# Altium project Блок вычислительный.PrjPcb (part 1 of 2)
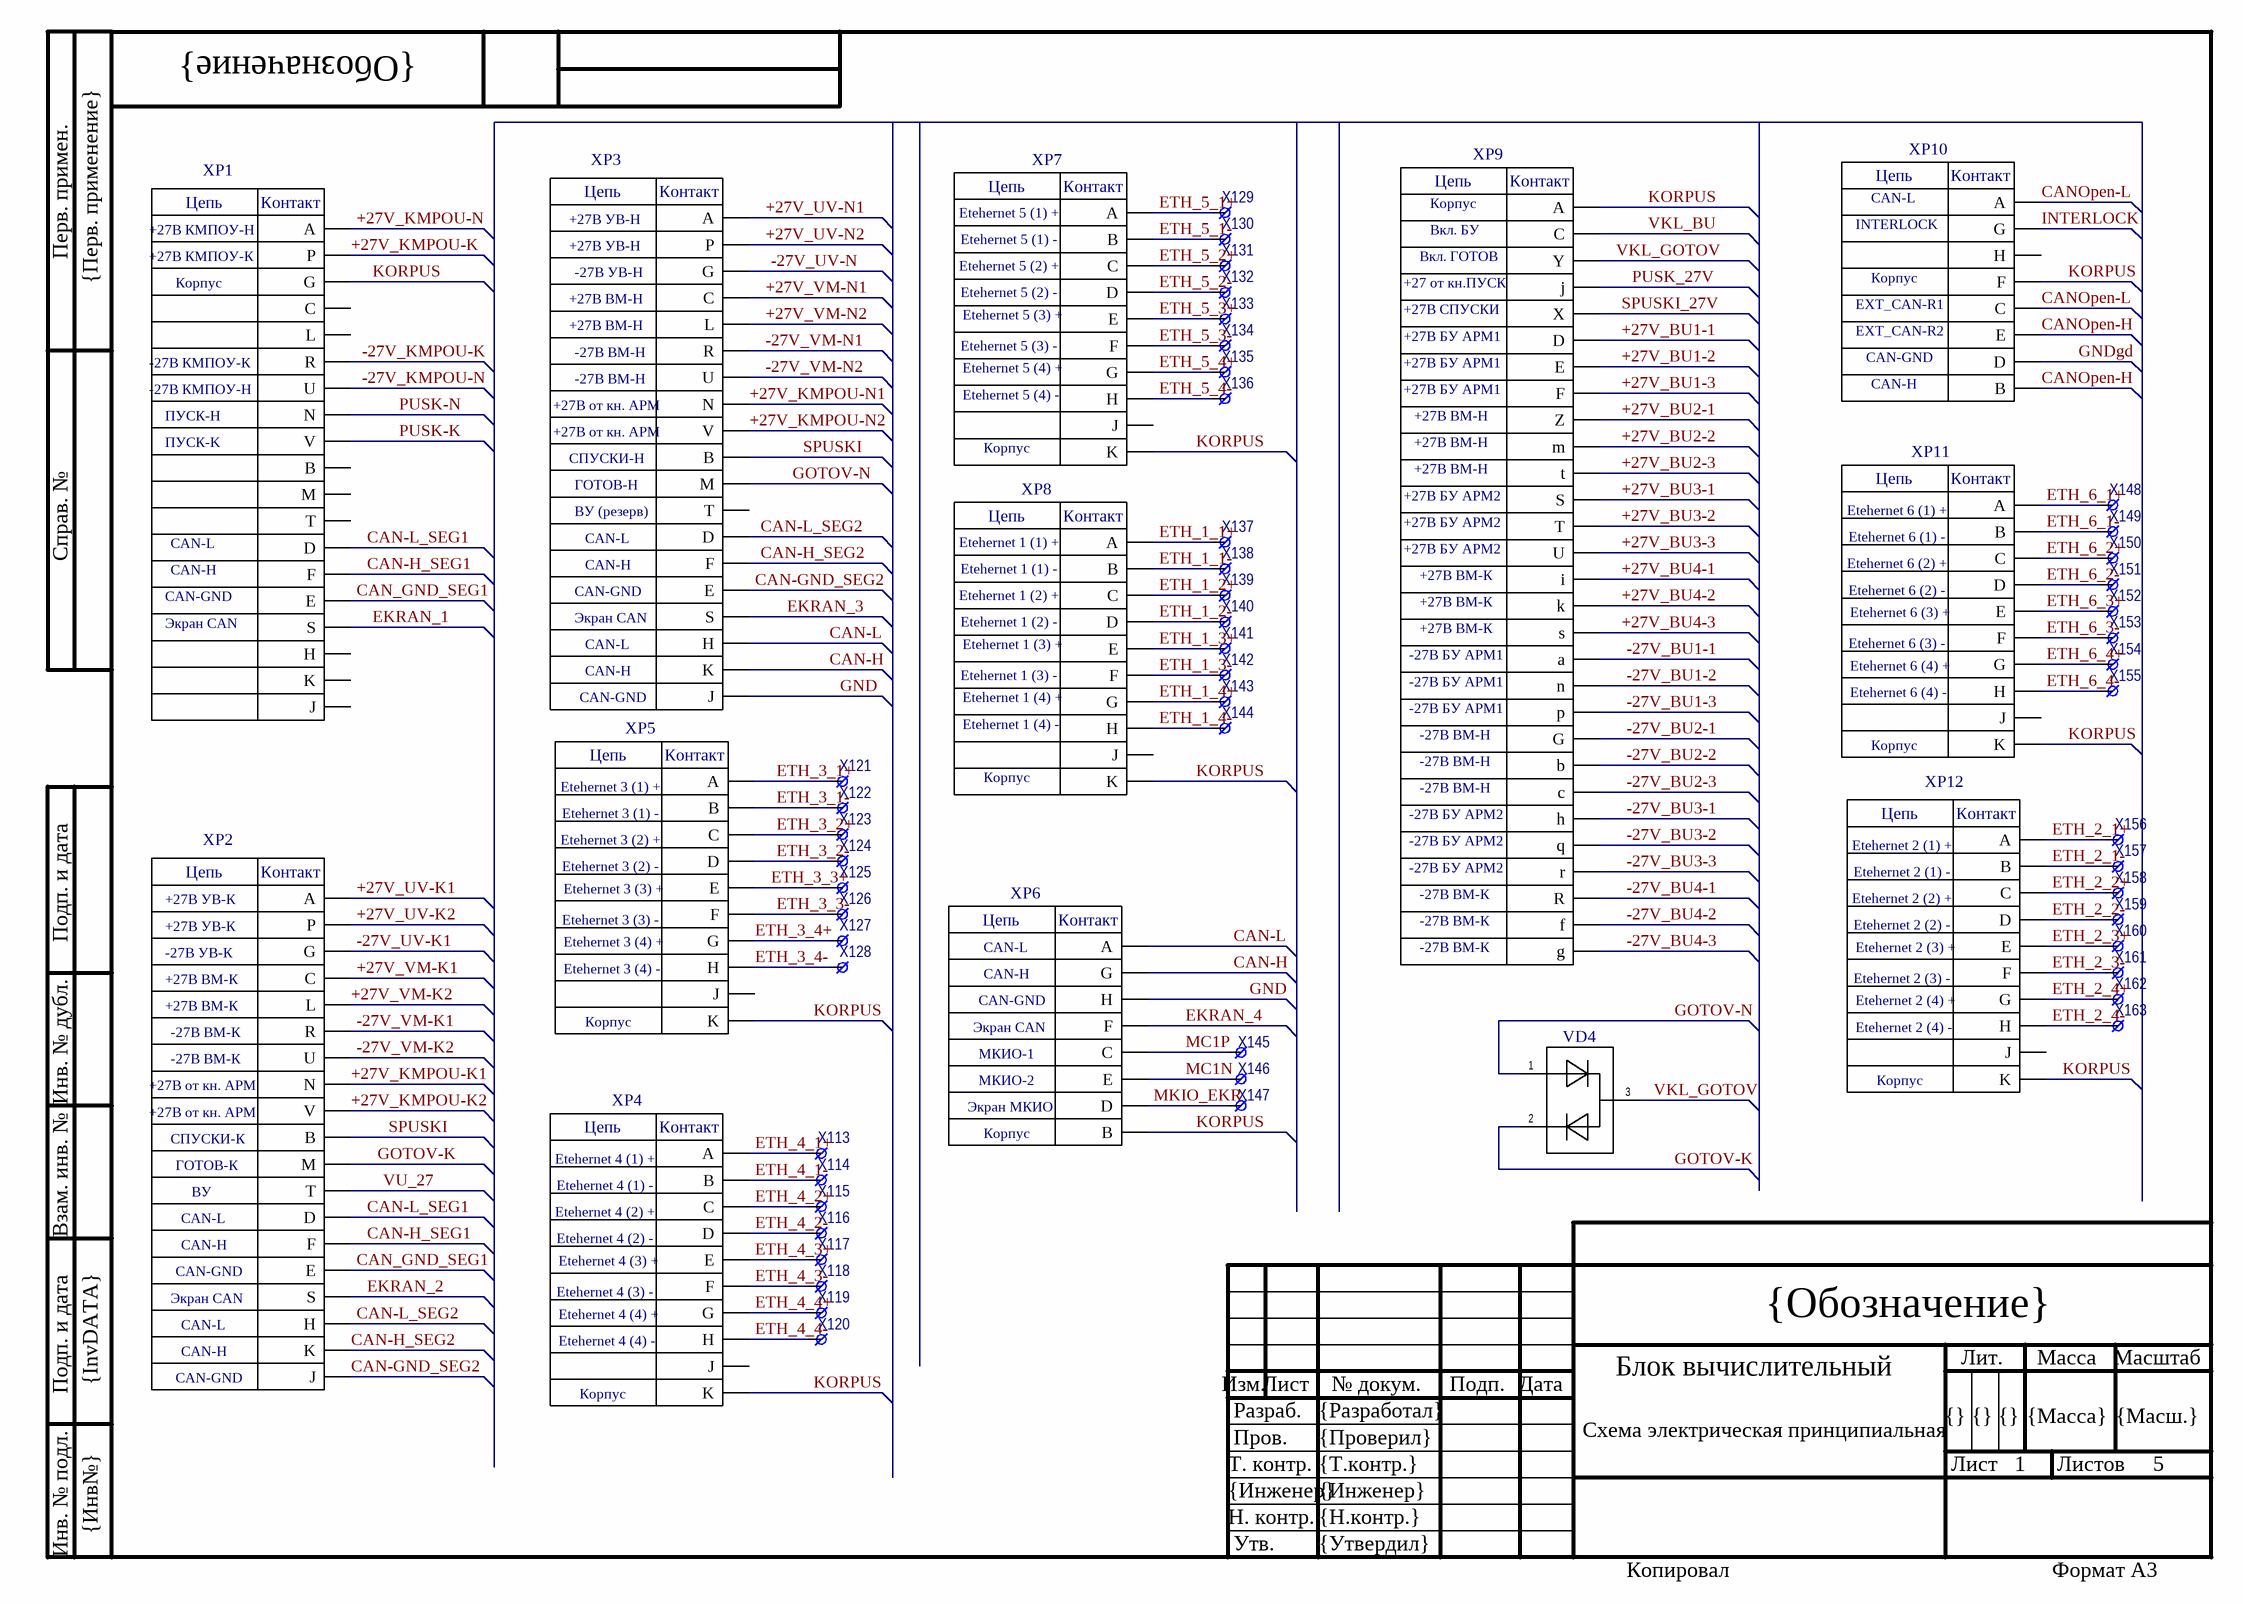
[diagram p0: ExternalConnection.SchDoc]
5 sheets, 441 parts. Net scope: global (net labels, ports and power ports of the same name join across sheets).
Board file: Блок 1а (БУ АРМ).PcbDoc
Sheets:
  ExternalConnection.SchDoc
  InternalConnection.SchDoc
  MCU1.SchDoc
  MCU2.SchDoc
  InterfMCU.SchDoc

## Sheet ExternalConnection.SchDoc: {Наименование}
size 420 x 297 mm; ApprovedBy: {Утвердил}; CheckedBy: {Проверил}; DrawnBy: {Разработал}; Engineer: {Инженер}; DocumentNumber: {Обозначение}; SheetNumber: 1; SheetTotal: 5; Scale: {Масш.}; Title1str: {Наименование}; PageSetup: Record=PageOptionsZCenterHorizontal=FalseZCenterVertical=FalseZPrintScale=0.95ZXCorrection=0.00ZYCorrection=0.00ZPrintKind=1ZBorderSize=5000000ZLeftOffset=0ZBottomOffset=0ZOrientation=1ZPaperLength=1000ZPaperWidth=1000ZScale=100ZPaperSource=15ZPrintQuality=600ZMediaType=1ZDitherType=10ZPaperKind=A4ZPrintScaleMode=1; Title2str: {Наименование}; ProcessInspection: {Т.контр.}; Mass: {Масса}; NormInspection: {Н.контр.}; EngineerName: {Инженер}; Letter1Column: {}; Letter2Column: {}; Letter3Column: {}; DocumentType: {Документ}; DocumentType1str: {Документ}; DocumentType2str: {Документ}; FirstReferrence: {Перв. применение}; InvNumber: {Инв№}; InvDATA: {InvDATA}; Title1str_small: {Наименование}; Title2str_small: {Наименование}; Rule: PcbType=ProtelPcb

### Parts
VD4  2Д707АС9  [KT-46]  (value not drawn)
X113  CONT  [ПЛАН_ПЛОЩ]  (value not drawn)
X114  CONT  [ПЛАН_ПЛОЩ]  (value not drawn)
X115  CONT  [ПЛАН_ПЛОЩ]  (value not drawn)
X116  CONT  [ПЛАН_ПЛОЩ]  (value not drawn)
X117  CONT  [ПЛАН_ПЛОЩ]  (value not drawn)
X118  CONT  [ПЛАН_ПЛОЩ]  (value not drawn)
X119  CONT  [ПЛАН_ПЛОЩ]  (value not drawn)
X120  CONT  [ПЛАН_ПЛОЩ]  (value not drawn)
X121  CONT  [ПЛАН_ПЛОЩ]  (value not drawn)
X122  CONT  [ПЛАН_ПЛОЩ]  (value not drawn)
X123  CONT  [ПЛАН_ПЛОЩ]  (value not drawn)
X124  CONT  [ПЛАН_ПЛОЩ]  (value not drawn)
X125  CONT  [ПЛАН_ПЛОЩ]  (value not drawn)
X126  CONT  [ПЛАН_ПЛОЩ]  (value not drawn)
X127  CONT  [ПЛАН_ПЛОЩ]  (value not drawn)
X128  CONT  [ПЛАН_ПЛОЩ]  (value not drawn)
X129  CONT  [ПЛАН_ПЛОЩ]  (value not drawn)
X130  CONT  [ПЛАН_ПЛОЩ]  (value not drawn)
X131  CONT  [ПЛАН_ПЛОЩ]  (value not drawn)
X132  CONT  [ПЛАН_ПЛОЩ]  (value not drawn)
X133  CONT  [ПЛАН_ПЛОЩ]  (value not drawn)
X134  CONT  [ПЛАН_ПЛОЩ]  (value not drawn)
X135  CONT  [ПЛАН_ПЛОЩ]  (value not drawn)
X136  CONT  [ПЛАН_ПЛОЩ]  (value not drawn)
X137  CONT  [ПЛАН_ПЛОЩ]  (value not drawn)
X138  CONT  [ПЛАН_ПЛОЩ]  (value not drawn)
X139  CONT  [ПЛАН_ПЛОЩ]  (value not drawn)
X140  CONT  [ПЛАН_ПЛОЩ]  (value not drawn)
X141  CONT  [ПЛАН_ПЛОЩ]  (value not drawn)
X142  CONT  [ПЛАН_ПЛОЩ]  (value not drawn)
X143  CONT  [ПЛАН_ПЛОЩ]  (value not drawn)
X144  CONT  [ПЛАН_ПЛОЩ]  (value not drawn)
X145  CONT  [ПЛАН_ПЛОЩ]  (value not drawn)
X146  CONT  [ПЛАН_ПЛОЩ]  (value not drawn)
X147  CONT  [ПЛАН_ПЛОЩ]  (value not drawn)
X148  CONT  [ПЛАН_ПЛОЩ]  (value not drawn)
X149  CONT  [ПЛАН_ПЛОЩ]  (value not drawn)
X150  CONT  [ПЛАН_ПЛОЩ]  (value not drawn)
X151  CONT  [ПЛАН_ПЛОЩ]  (value not drawn)
X152  CONT  [ПЛАН_ПЛОЩ]  (value not drawn)
X153  CONT  [ПЛАН_ПЛОЩ]  (value not drawn)
X154  CONT  [ПЛАН_ПЛОЩ]  (value not drawn)
X155  CONT  [ПЛАН_ПЛОЩ]  (value not drawn)
X156  CONT  [ПЛАН_ПЛОЩ]  (value not drawn)
X157  CONT  [ПЛАН_ПЛОЩ]  (value not drawn)
X158  CONT  [ПЛАН_ПЛОЩ]  (value not drawn)
X159  CONT  [ПЛАН_ПЛОЩ]  (value not drawn)
X160  CONT  [ПЛАН_ПЛОЩ]  (value not drawn)
X161  CONT  [ПЛАН_ПЛОЩ]  (value not drawn)
X162  CONT  [ПЛАН_ПЛОЩ]  (value not drawn)
X163  CONT  [ПЛАН_ПЛОЩ]  (value not drawn)
XP1  СНЦ144-19  [XP_СНЦ144-19/15-вилка]  (value not drawn)
XP2  СНЦ144-19  [XP_СНЦ144-19/15-вилка]  (value not drawn)
XP3  СНЦ144-19  [XP_СНЦ144-19/15-вилка]  (value not drawn)
XP4  СНЦ144-10  [XP_СНЦ144-10_13-вилка]  (value not drawn)
XP5  СНЦ144-10  [XP_СНЦ144-10_13-вилка]  (value not drawn)
XP6  СНЦ144-8  [XP_СНЦ144-8_13-Вилка]  (value not drawn)
XP7  СНЦ144-10  [XP_СНЦ144-10_13-вилка]  (value not drawn)
XP8  СНЦ144-10  [XP_СНЦ144-10_13-вилка]  (value not drawn)
XP9  СНЦ144-41  [XP_СНЦ144-41_21-вилка]  (value not drawn)
XP10  СНЦ144-8  [XP_СНЦ144-8_13-Вилка]  (value not drawn)
XP11  СНЦ144-10  [XP_СНЦ144-10_13-вилка]  (value not drawn)
XP12  СНЦ144-10  [XP_СНЦ144-10_13-вилка]  (value not drawn)

### Nets
GND: XP3.J XP6.H
+27V_BU1-1: XP9.D
+27V_BU1-2: XP9.E
+27V_BU1-3: XP9.F
+27V_BU2-1: XP9.Z
+27V_BU2-2: XP9.mm(m)
+27V_BU2-3: XP9.tt(t)
+27V_BU3-1: XP9.S
+27V_BU3-2: XP9.T
+27V_BU3-3: XP9.U
+27V_BU4-1: XP9.ii(i)
+27V_BU4-2: XP9.kk(k)
+27V_BU4-3: XP9.ss(s)
+27V_KMPOU-K: XP1.P
+27V_KMPOU-K1: XP2.N
+27V_KMPOU-K2: XP2.V
+27V_KMPOU-N: XP1.A
+27V_KMPOU-N1: XP3.N
+27V_KMPOU-N2: XP3.V
+27V_UV-K1: XP2.A
+27V_UV-K2: XP2.P
+27V_UV-N1: XP3.A
+27V_UV-N2: XP3.P
+27V_VM-K1: XP2.C
+27V_VM-K2: XP2.L
+27V_VM-N1: XP3.C
+27V_VM-N2: XP3.L
-27V_BU1-1: XP9.aa(a)
-27V_BU1-2: XP9.nn(n)
-27V_BU1-3: XP9.pp(p)
-27V_BU2-1: XP9.G
-27V_BU2-2: XP9.bb(b)
-27V_BU2-3: XP9.cc(c)
-27V_BU3-1: XP9.hh(h)
-27V_BU3-2: XP9.qq(q)
-27V_BU3-3: XP9.rr(r)
-27V_BU4-1: XP9.R
-27V_BU4-2: XP9.ff(f)
-27V_BU4-3: XP9.gg(g)
-27V_KMPOU-K: XP1.R
-27V_KMPOU-N: XP1.U
-27V_UV-K1: XP2.G
-27V_UV-N: XP3.G
-27V_VM-K1: XP2.R
-27V_VM-K2: XP2.U
-27V_VM-N1: XP3.R
-27V_VM-N2: XP3.U
CAN-GND_SEG2: XP2.J XP3.E
CAN-H: XP3.K XP6.G
CAN-H_SEG1: XP1.F XP2.F
CAN-H_SEG2: XP2.K XP3.F
CAN-L: XP3.H XP6.A
CAN-L_SEG1: XP1.D XP2.D
CAN-L_SEG2: XP2.H XP3.D
CAN_GND_SEG1: XP1.E XP2.E
CANOpen-H: XP10.B XP10.E
CANOpen-L: XP10.A XP10.C
EKRAN_1: XP1.S
EKRAN_2: XP2.S
EKRAN_3: XP3.S
EKRAN_4: XP6.F
ETH_1_1+: X137.1 XP8.A
ETH_1_1-: X138.1 XP8.B
ETH_1_2+: X139.1 XP8.C
ETH_1_2-: X140.1 XP8.D
ETH_1_3+: X141.1 XP8.E
ETH_1_3-: X142.1 XP8.F
ETH_1_4+: X143.1 XP8.G
ETH_1_4-: X144.1 XP8.H
ETH_2_1+: X156.1 XP12.A
ETH_2_1-: X157.1 XP12.B
ETH_2_2+: X158.1 XP12.C
ETH_2_2-: X159.1 XP12.D
ETH_2_3+: X160.1 XP12.E
ETH_2_3-: X161.1 XP12.F
ETH_2_4+: X162.1 XP12.G
ETH_2_4-: X163.1 XP12.H
ETH_3_1+: X121.1 XP5.A
ETH_3_1-: X122.1 XP5.B
ETH_3_2+: X123.1 XP5.C
ETH_3_2-: X124.1 XP5.D
ETH_3_3+: X125.1 XP5.E
ETH_3_3-: X126.1 XP5.F
ETH_3_4+: X127.1 XP5.G
ETH_3_4-: X128.1 XP5.H
ETH_4_1+: X113.1 XP4.A
ETH_4_1-: X114.1 XP4.B
ETH_4_2+: X115.1 XP4.C
ETH_4_2-: X116.1 XP4.D
ETH_4_3+: X117.1 XP4.E
ETH_4_3-: X118.1 XP4.F
ETH_4_4+: X119.1 XP4.G
ETH_4_4-: X120.1 XP4.H
ETH_5_1+: X129.1 XP7.A
ETH_5_1-: X130.1 XP7.B
ETH_5_2+: X131.1 XP7.C
ETH_5_2-: X132.1 XP7.D
ETH_5_3+: X133.1 XP7.E
ETH_5_3-: X134.1 XP7.F
ETH_5_4+: X135.1 XP7.G
ETH_5_4-: X136.1 XP7.H
ETH_6_1+: X148.1 XP11.A
ETH_6_1-: X149.1 XP11.B
ETH_6_2+: X150.1 XP11.C
ETH_6_2-: X151.1 XP11.D
ETH_6_3+: X152.1 XP11.E
ETH_6_3-: X153.1 XP11.F
ETH_6_4+: X154.1 XP11.G
ETH_6_4-: X155.1 XP11.H
GNDgd: XP10.D
GOTOV-K: VD4.2 XP2.M
GOTOV-N: VD4.1 XP3.M
INTERLOCK: XP10.G
KORPUS: XP1.G XP4.K XP5.K XP6.B XP7.K XP8.K XP9.A XP10.F XP11.K XP12.K
MC1N: X146.1 XP6.E
MC1P: X145.1 XP6.C
MKIO_EKR: X147.1 XP6.D
PUSK-K: XP1.V
PUSK-N: XP1.N
PUSK_27V: XP9.jj(j)
SPUSKI: XP2.B XP3.B
SPUSKI_27V: XP9.X
VKL_BU: XP9.C
VKL_GOTOV: VD4.3 XP9.Y
VU_27: XP2.T

Not connected (* = marked no-connect by the designer): XP1 B C H J K L M T; XP3 T; XP4 J; XP5 J; XP7 J; XP8 J; XP10 H; XP11 J; XP12 J

### Notes on the sheet
- Перв. примен.
- +27В КМПОУ-Н
- +27В КМПОУ-К
- +27В УВ-Н
- Etehernet 5 (1) +
- Etehernet 5 (1) -
- Etehernet 5 (2) +
- Вкл. ГОТОВ
- Корпус
- Вкл. БУ
- INTERLOCK
- CAN-L
- +27В ВМ-Н
- -27В УВ-Н
- (near XP7) Etehernet 5 (3) +
- Etehernet 5 (2) -
- +27 от кн.ПУСК
- +27В СПУСКИ
- EXT_CAN-R1
- -27В КМПОУ-Н
- -27В КМПОУ-К
- -27В ВМ-Н
- (near XP7) Etehernet 5 (4) +
- Etehernet 5 (3) -
- +27В БУ АРМ1
- EXT_CAN-R2
- CAN-GND
- CAN-H
- ПУСК-Н
- ПУСК-K
- +27В от кн. АРМ
- СПУСКИ-Н
- (near XP7) Etehernet 5 (4) -
- Справ. №
- ГОТОВ-Н
- ВУ (резерв)
- +27В БУ АРМ2
- Etehernet 6 (1) +
- Etehernet 6 (1) -
- Etehernet 1 (1) +
- Etehernet 1 (1) -
- Etehernet 1 (2) +
- +27В ВМ-К
- Etehernet 6 (2) +
- Etehernet 6 (2) -
- Экран CAN
- (near XP8) Etehernet 1 (3) +
- Etehernet 1 (2) -
- -27В БУ АРМ1
- (near XP11) Etehernet 6 (3) +
- Etehernet 6 (3) -
- (near XP8) Etehernet 1 (4) +
- (near XP8) Etehernet 1 (4) -
- Etehernet 1 (3) -
- (near XP11) Etehernet 6 (4) +
- (near XP11) Etehernet 6 (4) -
- Etehernet 3 (1) +
- Etehernet 3 (1) -
- Etehernet 3 (2) +
- Etehernet 3 (2) -
- -27В БУ АРМ2
- Etehernet 2 (1) +
- Etehernet 2 (1) -
- Подп. и дата
- +27В УВ-К
- (near XP5) Etehernet 3 (3) +
- Etehernet 3 (3) -
- -27В ВМ-К
- Etehernet 2 (2) +
- Etehernet 2 (2) -
- -27В УВ-К
- (near XP5) Etehernet 3 (4) +
- (near XP5) Etehernet 3 (4) -
- (near XP12) Etehernet 2 (3) +
- (near XP12) Etehernet 2 (4) +
- Etehernet 2 (3) -
- Инв. № дубл.
- МКИО-1
- (near XP12) Etehernet 2 (4) -
- Экран МКИО
- МКИО-2
- Взам. инв. №
- СПУСКИ-К
- ГОТОВ-К
- ВУ
- Etehernet 4 (1) +
- Etehernet 4 (1) -
- Etehernet 4 (2) +
- (near XP4) Etehernet 4 (3) +
- Etehernet 4 (2) -
- (near XP4) Etehernet 4 (4) +
- Etehernet 4 (3) -
- (near XP4) Etehernet 4 (4) -
- Изм.
- Лист
- № докум.
- Подп.
- Дата
- Блок вычислительный
- Лит.
- Масса
- Масштаб
- Т. контр.
- Пров.
- Разраб.
- Схема электрическая принципиальная
- Листов
- Инв. № подл.
- Н. контр.
- Утв.
- Копировал
- Формат А3
- (in symbol СНЦ144-8) Цепь; Контакт
- (in symbol СНЦ144-10) Цепь; Контакт
- (in symbol СНЦ144-19) Цепь; Контакт
- (in symbol СНЦ144-41) Цепь; Контакт

### Library data of the parts
VD4 = 2Д707АС9: 2Д707АС9 диод импульсный; TU: аА0.339.583ТУ; TUHolder: ООО "НПК ДАЛЕКС"; TypePrefix: VD; Value: *; PartNumber: 2Д707АС9
X113-X163 = CONT: CONT1_SMD; PartNumber: контактное поле; Value: *
XP1-XP3 = СНЦ144-19: ВИЛКА СНЦ144-19 СОСТАВНАЯ; PartNumber: СНЦ144-19/15ВП21-NWПС; Value: Вилка СНЦ144-19/15ВП21-NWПС; TypePrefix: Изделия соеденительные; TU: ЦСНК.430421.008ТУ; TUHolder: ОАО 'Уральский завод электрических соединителей 'ИСЕТЬ', Россия, г. Каменск-Уральский; PackegeType: *
XP4 XP5 XP7 XP8 XP11 XP12 = СНЦ144-10: ВИЛКА СНЦ144-10 СОСТАВНАЯ; PartNumber: СНЦ144-10/13ВП21-NWПС; Value: Вилка СНЦ144-10/13ВП21-NWПС; TU: ЦСНК.430421.008ТУ; TUHolder: ОАО 'Уральский завод электрических соединителей 'ИСЕТЬ', Россия, г. Каменск-Уральский; TypePrefix: Изделия соеденительные; PackegeType: *
XP6 XP10 = СНЦ144-8: ВИЛКА СНЦ144-8 СОСТАВНАЯ; PartNumber: СНЦ144-8/13ВП21-NWПС; Value: Вилка СНЦ144-8/13ВП21-NWПС; TU: ЦСНК.430421.008ТУ; TUHolder: ОАО 'Уральский завод электрических соединителей 'ИСЕТЬ', Россия, г. Каменск-Уральский; TypePrefix: Изделия соеденительные; PackegeType: *
XP9 = СНЦ144-41: ВИЛКА СНЦ144-41 СОСТАВНАЯ; PartNumber: СНЦ144-41/21ВП21-NWПС; Value: Вилка СНЦ144-41/21ВП21-NWПС; TU: ЦСНК.430421.008ТУ; TUHolder: ОАО 'Уральский завод электрических соединителей 'ИСЕТЬ', Россия, г. Каменск-Уральский; TypePrefix: Изделия соеденительные; PackegeType: *

## Sheet InternalConnection.SchDoc
size 420 x 297 mm; Address1: Address1; Address2: Address2; Address3: Address3; Address4: Address4; SheetNumber: 2; SheetTotal: 5; Scale: 1:1; DocumentType: Схема электрическая принципиальная
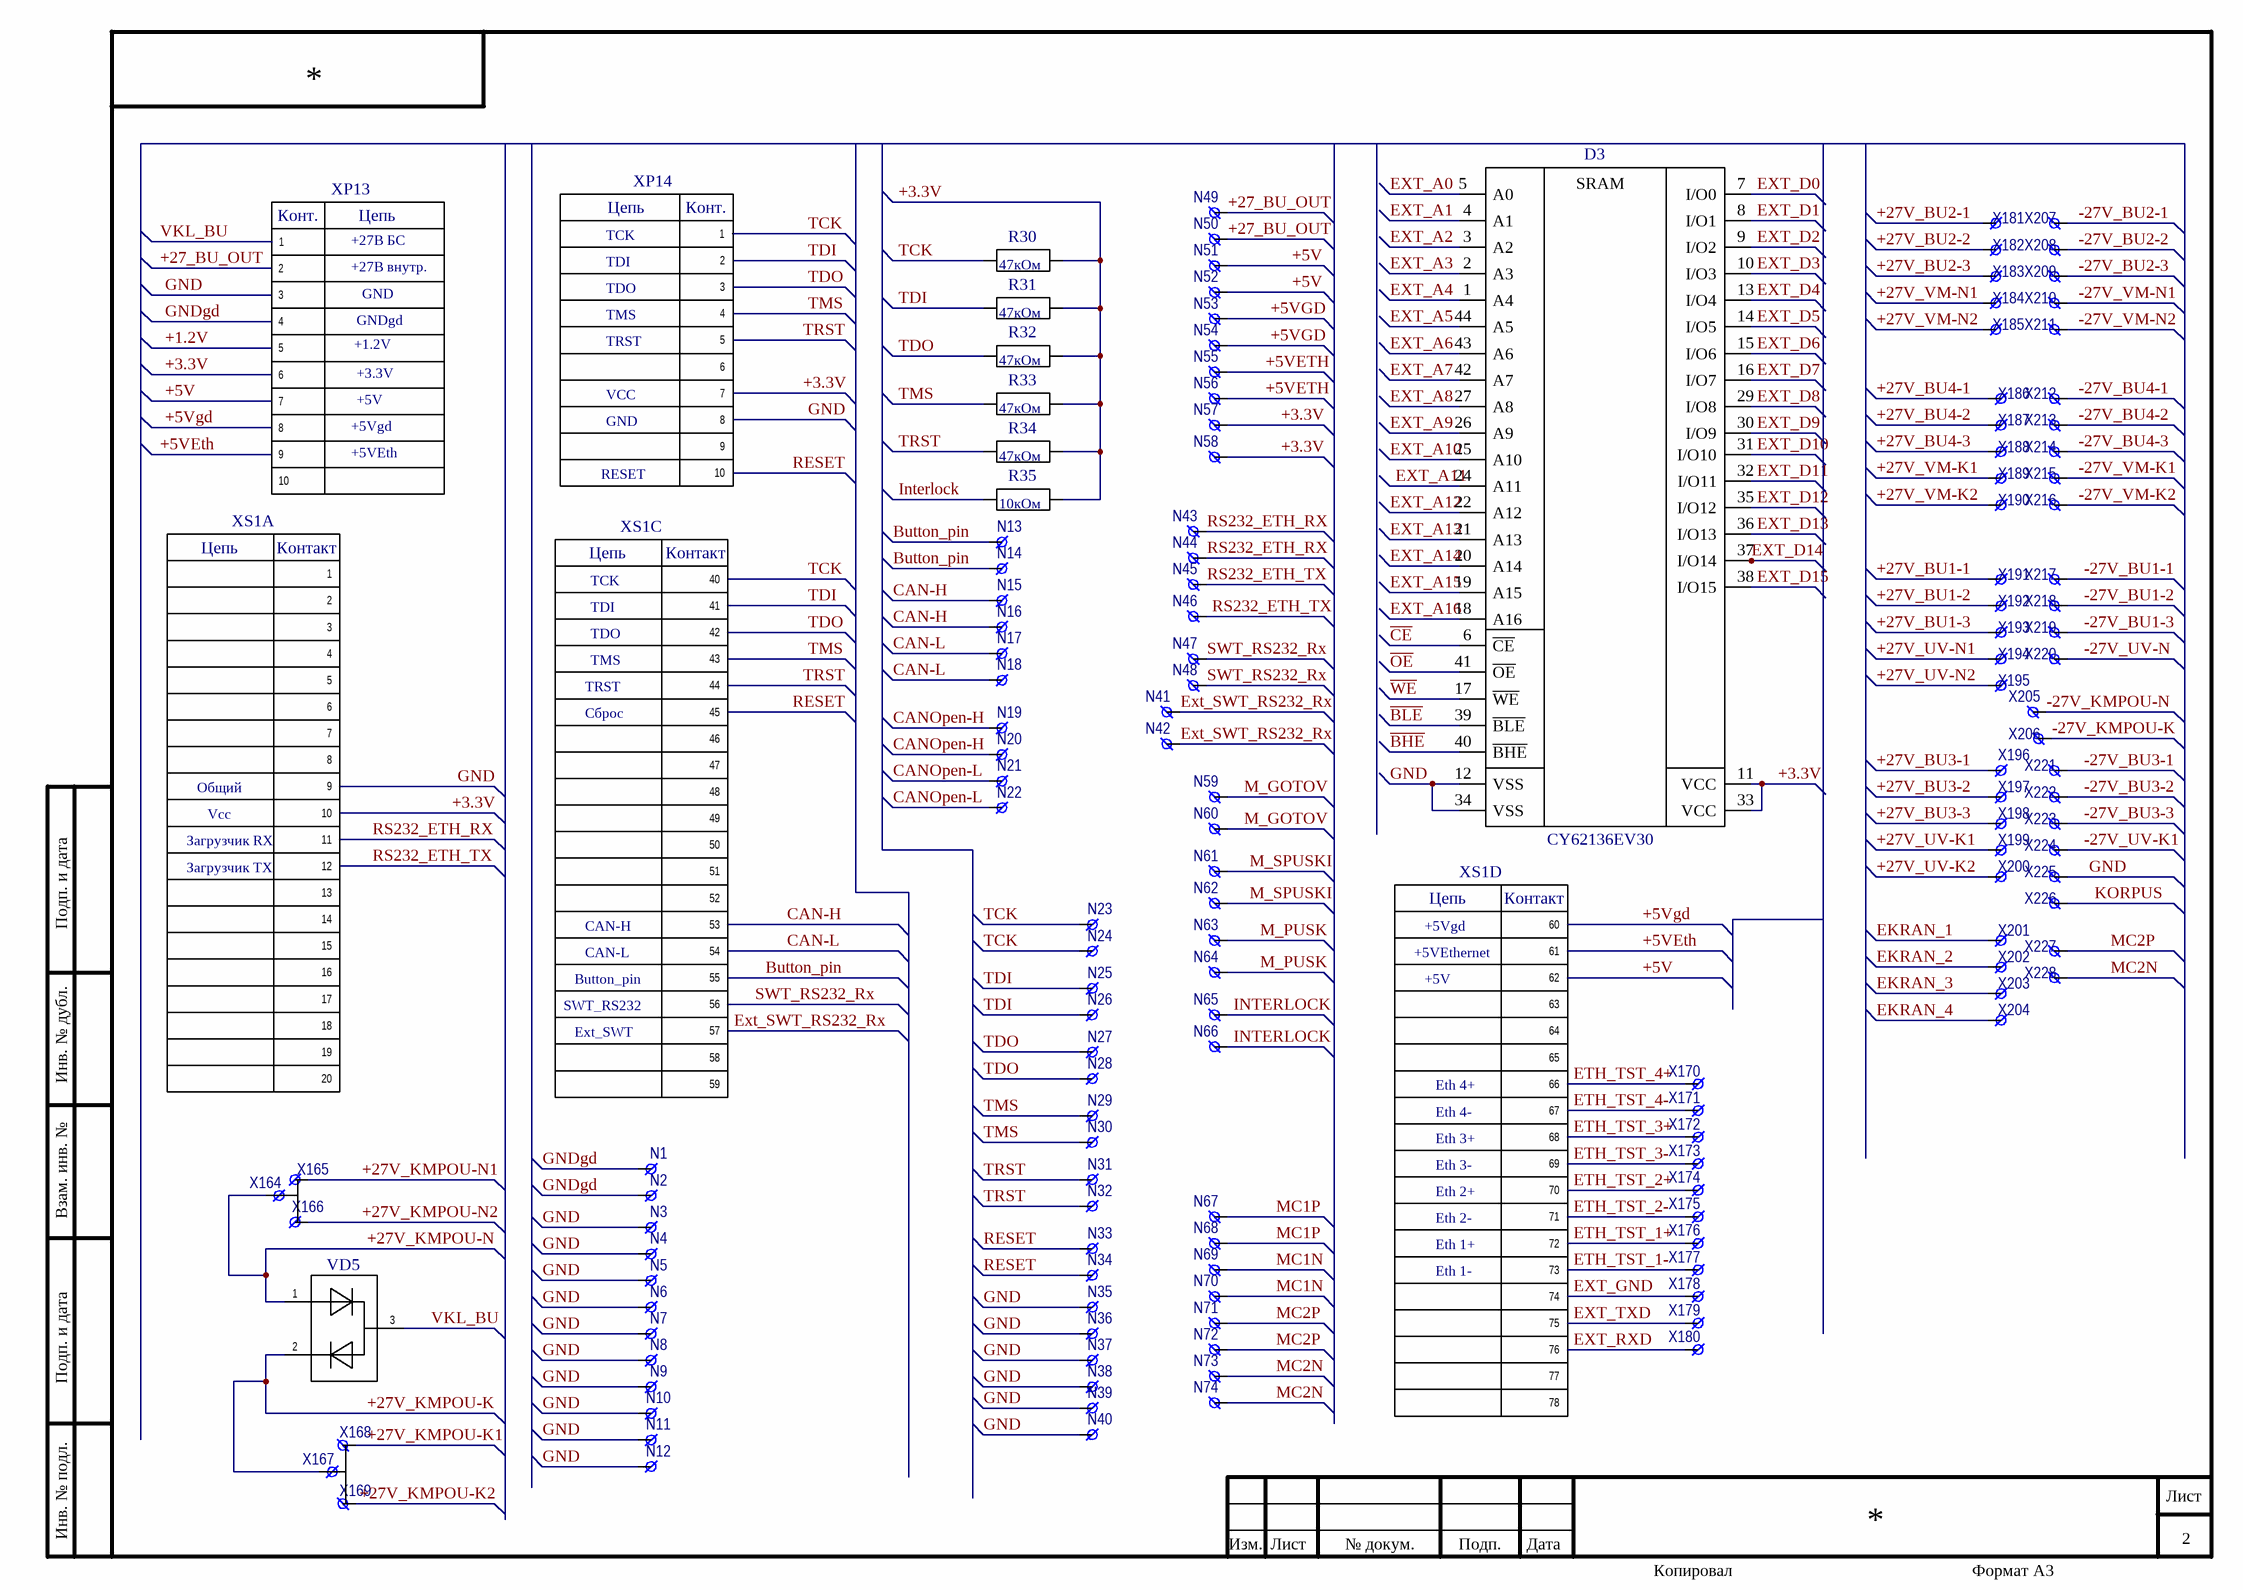
[diagram p1: InternalConnection.SchDoc]

### Parts
D3  CY62136EV30  [TSOP-44]
N1  CONT  [ПЛАН_ПЛОЩ]  (value not drawn)
N2  CONT  [ПЛАН_ПЛОЩ]  (value not drawn)
N3  CONT  [ПЛАН_ПЛОЩ]  (value not drawn)
N4  CONT  [ПЛАН_ПЛОЩ]  (value not drawn)
N5  CONT  [ПЛАН_ПЛОЩ]  (value not drawn)
N6  CONT  [ПЛАН_ПЛОЩ]  (value not drawn)
N7  CONT  [ПЛАН_ПЛОЩ]  (value not drawn)
N8  CONT  [ПЛАН_ПЛОЩ]  (value not drawn)
N9  CONT  [ПЛАН_ПЛОЩ]  (value not drawn)
N10  CONT  [ПЛАН_ПЛОЩ]  (value not drawn)
N11  CONT  [ПЛАН_ПЛОЩ]  (value not drawn)
N12  CONT  [ПЛАН_ПЛОЩ]  (value not drawn)
N13  CONT  [ПЛАН_ПЛОЩ]  (value not drawn)
N14  CONT  [ПЛАН_ПЛОЩ]  (value not drawn)
N15  CONT  [ПЛАН_ПЛОЩ]  (value not drawn)
N16  CONT  [ПЛАН_ПЛОЩ]  (value not drawn)
N17  CONT  [ПЛАН_ПЛОЩ]  (value not drawn)
N18  CONT  [ПЛАН_ПЛОЩ]  (value not drawn)
N19  CONT  [ПЛАН_ПЛОЩ]  (value not drawn)
N20  CONT  [ПЛАН_ПЛОЩ]  (value not drawn)
N21  CONT  [ПЛАН_ПЛОЩ]  (value not drawn)
N22  CONT  [ПЛАН_ПЛОЩ]  (value not drawn)
N23  CONT  [ПЛАН_ПЛОЩ]  (value not drawn)
N24  CONT  [ПЛАН_ПЛОЩ]  (value not drawn)
N25  CONT  [ПЛАН_ПЛОЩ]  (value not drawn)
N26  CONT  [ПЛАН_ПЛОЩ]  (value not drawn)
N27  CONT  [ПЛАН_ПЛОЩ]  (value not drawn)
N28  CONT  [ПЛАН_ПЛОЩ]  (value not drawn)
N29  CONT  [ПЛАН_ПЛОЩ]  (value not drawn)
N30  CONT  [ПЛАН_ПЛОЩ]  (value not drawn)
N31  CONT  [ПЛАН_ПЛОЩ]  (value not drawn)
N32  CONT  [ПЛАН_ПЛОЩ]  (value not drawn)
N33  CONT  [ПЛАН_ПЛОЩ]  (value not drawn)
N34  CONT  [ПЛАН_ПЛОЩ]  (value not drawn)
N35  CONT  [ПЛАН_ПЛОЩ]  (value not drawn)
N36  CONT  [ПЛАН_ПЛОЩ]  (value not drawn)
N37  CONT  [ПЛАН_ПЛОЩ]  (value not drawn)
N38  CONT  [ПЛАН_ПЛОЩ]  (value not drawn)
N39  CONT  [ПЛАН_ПЛОЩ]  (value not drawn)
N40  CONT  [ПЛАН_ПЛОЩ]  (value not drawn)
N41  CONT  [ПЛАН_ПЛОЩ]  (value not drawn)
N42  CONT  [ПЛАН_ПЛОЩ]  (value not drawn)
N43  CONT  [ПЛАН_ПЛОЩ]  (value not drawn)
N44  CONT  [ПЛАН_ПЛОЩ]  (value not drawn)
N45  CONT  [ПЛАН_ПЛОЩ]  (value not drawn)
N46  CONT  [ПЛАН_ПЛОЩ]  (value not drawn)
N47  CONT  [ПЛАН_ПЛОЩ]  (value not drawn)
N48  CONT  [ПЛАН_ПЛОЩ]  (value not drawn)
N49  CONT  [ПЛАН_ПЛОЩ]  (value not drawn)
N50  CONT  [ПЛАН_ПЛОЩ]  (value not drawn)
N51  CONT  [ПЛАН_ПЛОЩ]  (value not drawn)
N52  CONT  [ПЛАН_ПЛОЩ]  (value not drawn)
N53  CONT  [ПЛАН_ПЛОЩ]  (value not drawn)
N54  CONT  [ПЛАН_ПЛОЩ]  (value not drawn)
N55  CONT  [ПЛАН_ПЛОЩ]  (value not drawn)
N56  CONT  [ПЛАН_ПЛОЩ]  (value not drawn)
N57  CONT  [ПЛАН_ПЛОЩ]  (value not drawn)
N58  CONT  [ПЛАН_ПЛОЩ]  (value not drawn)
N59  CONT  [ПЛАН_ПЛОЩ]  (value not drawn)
N60  CONT  [ПЛАН_ПЛОЩ]  (value not drawn)
N61  CONT  [ПЛАН_ПЛОЩ]  (value not drawn)
N62  CONT  [ПЛАН_ПЛОЩ]  (value not drawn)
N63  CONT  [ПЛАН_ПЛОЩ]  (value not drawn)
N64  CONT  [ПЛАН_ПЛОЩ]  (value not drawn)
N65  CONT  [ПЛАН_ПЛОЩ]  (value not drawn)
N66  CONT  [ПЛАН_ПЛОЩ]  (value not drawn)
N67  CONT  [ПЛАН_ПЛОЩ]  (value not drawn)
N68  CONT  [ПЛАН_ПЛОЩ]  (value not drawn)
N69  CONT  [ПЛАН_ПЛОЩ]  (value not drawn)
N70  CONT  [ПЛАН_ПЛОЩ]  (value not drawn)
N71  CONT  [ПЛАН_ПЛОЩ]  (value not drawn)
N72  CONT  [ПЛАН_ПЛОЩ]  (value not drawn)
N73  CONT  [ПЛАН_ПЛОЩ]  (value not drawn)
N74  CONT  [ПЛАН_ПЛОЩ]  (value not drawn)
R30  47кОм  [P1-12-0.125(0805)]
R31  47кОм  [P1-12-0.125(0805)]
R32  47кОм  [P1-12-0.125(0805)]
R33  47кОм  [P1-12-0.125(0805)]
R34  47кОм  [P1-12-0.125(0805)]
R35  10кОм  [P1-12-0.125(0805)]
VD5  2Д707АС9  [KT-46]  (value not drawn)
X164  CONT  [ПЛАН_ПЛОЩ]  (value not drawn)
X165  CONT  [ПЛАН_ПЛОЩ]  (value not drawn)
X166  CONT  [ПЛАН_ПЛОЩ]  (value not drawn)
X167  CONT  [ПЛАН_ПЛОЩ]  (value not drawn)
X168  CONT  [ПЛАН_ПЛОЩ]  (value not drawn)
X169  CONT  [ПЛАН_ПЛОЩ]  (value not drawn)
X170  CONT  [ПЛАН_ПЛОЩ]  (value not drawn)
X171  CONT  [ПЛАН_ПЛОЩ]  (value not drawn)
X172  CONT  [ПЛАН_ПЛОЩ]  (value not drawn)
X173  CONT  [ПЛАН_ПЛОЩ]  (value not drawn)
X174  CONT  [ПЛАН_ПЛОЩ]  (value not drawn)
X175  CONT  [ПЛАН_ПЛОЩ]  (value not drawn)
X176  CONT  [ПЛАН_ПЛОЩ]  (value not drawn)
X177  CONT  [ПЛАН_ПЛОЩ]  (value not drawn)
X178  CONT  [ПЛАН_ПЛОЩ]  (value not drawn)
X179  CONT  [ПЛАН_ПЛОЩ]  (value not drawn)
X180  CONT  [ПЛАН_ПЛОЩ]  (value not drawn)
X181  CONT  [ПЛАН_ПЛОЩ]  (value not drawn)
X182  CONT  [ПЛАН_ПЛОЩ]  (value not drawn)
X183  CONT  [ПЛАН_ПЛОЩ]  (value not drawn)
X184  CONT  [ПЛАН_ПЛОЩ]  (value not drawn)
X185  CONT  [ПЛАН_ПЛОЩ]  (value not drawn)
X186  CONT  [ПЛАН_ПЛОЩ]  (value not drawn)
X187  CONT  [ПЛАН_ПЛОЩ]  (value not drawn)
X188  CONT  [ПЛАН_ПЛОЩ]  (value not drawn)
X189  CONT  [ПЛАН_ПЛОЩ]  (value not drawn)
X190  CONT  [ПЛАН_ПЛОЩ]  (value not drawn)
X191  CONT  [ПЛАН_ПЛОЩ]  (value not drawn)
X192  CONT  [ПЛАН_ПЛОЩ]  (value not drawn)
X193  CONT  [ПЛАН_ПЛОЩ]  (value not drawn)
X194  CONT  [ПЛАН_ПЛОЩ]  (value not drawn)
X195  CONT  [ПЛАН_ПЛОЩ]  (value not drawn)
X196  CONT  [ПЛАН_ПЛОЩ]  (value not drawn)
X197  CONT  [ПЛАН_ПЛОЩ]  (value not drawn)
X198  CONT  [ПЛАН_ПЛОЩ]  (value not drawn)
X199  CONT  [ПЛАН_ПЛОЩ]  (value not drawn)
X200  CONT  [ПЛАН_ПЛОЩ]  (value not drawn)
X201  CONT  [ПЛАН_ПЛОЩ]  (value not drawn)
X202  CONT  [ПЛАН_ПЛОЩ]  (value not drawn)
X203  CONT  [ПЛАН_ПЛОЩ]  (value not drawn)
X204  CONT  [ПЛАН_ПЛОЩ]  (value not drawn)
X205  CONT  [ПЛАН_ПЛОЩ]  (value not drawn)
X206  CONT  [ПЛАН_ПЛОЩ]  (value not drawn)
X207  CONT  [ПЛАН_ПЛОЩ]  (value not drawn)
X208  CONT  [ПЛАН_ПЛОЩ]  (value not drawn)
X209  CONT  [ПЛАН_ПЛОЩ]  (value not drawn)
X210  CONT  [ПЛАН_ПЛОЩ]  (value not drawn)
X211  CONT  [ПЛАН_ПЛОЩ]  (value not drawn)
X212  CONT  [ПЛАН_ПЛОЩ]  (value not drawn)
X213  CONT  [ПЛАН_ПЛОЩ]  (value not drawn)
X214  CONT  [ПЛАН_ПЛОЩ]  (value not drawn)
X215  CONT  [ПЛАН_ПЛОЩ]  (value not drawn)
X216  CONT  [ПЛАН_ПЛОЩ]  (value not drawn)
X217  CONT  [ПЛАН_ПЛОЩ]  (value not drawn)
X218  CONT  [ПЛАН_ПЛОЩ]  (value not drawn)
X219  CONT  [ПЛАН_ПЛОЩ]  (value not drawn)
X220  CONT  [ПЛАН_ПЛОЩ]  (value not drawn)
X221  CONT  [ПЛАН_ПЛОЩ]  (value not drawn)
X222  CONT  [ПЛАН_ПЛОЩ]  (value not drawn)
X223  CONT  [ПЛАН_ПЛОЩ]  (value not drawn)
X224  CONT  [ПЛАН_ПЛОЩ]  (value not drawn)
X225  CONT  [ПЛАН_ПЛОЩ]  (value not drawn)
X226  CONT  [ПЛАН_ПЛОЩ]  (value not drawn)
X227  CONT  [ПЛАН_ПЛОЩ]  (value not drawn)
X228  CONT  [ПЛАН_ПЛОЩ]  (value not drawn)
XP13  PBS-10(R)  [PBS-10R]  (value not drawn)
XP14  ARM10PIN_КОНТ  [PLD-10]  (value not drawn)
XS1  ВИЛКА DS1077-78M  [DS-1077-78F]  (value not drawn)  (parts A,C,D of 4)

### Nets
+1.2V: XP13.5
+3.3V: D3.11(VCC) D3.33(VCC) N57.1 N58.1 R30.2 R31.2 R32.2 R33.2 R34.2 R35.2 XP13.6 XP14.7 XS1.10
GND: D3.12(VSS) D3.34(VSS) N3.1 N4.1 N5.1 N6.1 N7.1 N8.1 N9.1 N10.1 N11.1 N12.1 N35.1 N36.1 N37.1 N38.1 N39.1 N40.1 X225.1 XP13.3 XP14.8 XS1.9
+5V: N51.1 N52.1 XP13.7 XS1.62
+5VETH: N55.1 N56.1 XP13.9 XS1.61
+5VGD: N53.1 N54.1 XP13.8 XS1.60
+27_BU_OUT: N49.1 N50.1 XP13.2
+27V_BU1-1: X191.1
+27V_BU1-2: X192.1
+27V_BU1-3: X193.1
+27V_BU2-1: X181.1
+27V_BU2-2: X182.1
+27V_BU2-3: X183.1
+27V_BU3-1: X196.1
+27V_BU3-2: X197.1
+27V_BU3-3: X198.1
+27V_BU4-1: X186.1
+27V_BU4-2: X187.1
+27V_BU4-3: X188.1
+27V_KMPOU-K: VD5.2 X167.1
+27V_KMPOU-K1: X168.1
+27V_KMPOU-K2: X169.1
+27V_KMPOU-N: VD5.1 X164.1
+27V_KMPOU-N1: X165.1
+27V_KMPOU-N2: X166.1
+27V_UV-K1: X199.1
+27V_UV-K2: X200.1
+27V_UV-N1: X194.1
+27V_UV-N2: X195.1
+27V_VM-K1: X189.1
+27V_VM-K2: X190.1
+27V_VM-N1: X184.1
+27V_VM-N2: X185.1
-27V_BU1-1: X217.1
-27V_BU1-2: X218.1
-27V_BU1-3: X219.1
-27V_BU2-1: X207.1
-27V_BU2-2: X208.1
-27V_BU2-3: X209.1
-27V_BU3-1: X221.1
-27V_BU3-2: X222.1
-27V_BU3-3: X223.1
-27V_BU4-1: X212.1
-27V_BU4-2: X213.1
-27V_BU4-3: X214.1
-27V_KMPOU-K: X206.1
-27V_KMPOU-N: X205.1
-27V_UV-K1: X224.1
-27V_UV-N: X220.1
-27V_VM-K1: X215.1
-27V_VM-K2: X216.1
-27V_VM-N1: X210.1
-27V_VM-N2: X211.1
~{BHE}: D3.40(~{BHE})
~{BLE}: D3.39(~{BLE})
~{CE}: D3.6(~{CE})
~{OE}: D3.41(~{OE})
~{WE}: D3.17(~{WE})
Button_pin: N13.1 N14.1 XS1.55
CAN-H: N15.1 N16.1 XS1.53
CAN-L: N17.1 N18.1 XS1.54
CANOpen-H: N19.1 N20.1
CANOpen-L: N21.1 N22.1
EKRAN_1: X201.1
EKRAN_2: X202.1
EKRAN_3: X203.1
EKRAN_4: X204.1
ETH_TST_1+: X176.1 XS1.72
ETH_TST_1-: X177.1 XS1.73
ETH_TST_2+: X174.1 XS1.70
ETH_TST_2-: X175.1 XS1.71
ETH_TST_3+: X172.1 XS1.68
ETH_TST_3-: X173.1 XS1.69
ETH_TST_4+: X170.1 XS1.66
ETH_TST_4-: X171.1 XS1.67
EXT_A0: D3.5(A0)
EXT_A1: D3.4(A1)
EXT_A2: D3.3(A2)
EXT_A3: D3.2(A3)
EXT_A4: D3.1(A4)
EXT_A5: D3.44(A5)
EXT_A6: D3.43(A6)
EXT_A7: D3.42(A7)
EXT_A8: D3.27(A8)
EXT_A9: D3.26(A9)
EXT_A10: D3.25(A10)
EXT_A11: D3.24(A11)
EXT_A12: D3.22(A12)
EXT_A13: D3.21(A13)
EXT_A14: D3.20(A14)
EXT_A15: D3.19(A15)
EXT_A16: D3.18(A16)
EXT_D0: D3.7(I/O0)
EXT_D1: D3.8(I/O1)
EXT_D2: D3.9(I/O2)
EXT_D3: D3.10(I/O3)
EXT_D4: D3.13(I/O4)
EXT_D5: D3.14(I/O5)
EXT_D6: D3.15(I/O6)
EXT_D7: D3.16(I/O7)
EXT_D8: D3.29(I/O8)
EXT_D9: D3.30(I/O9)
EXT_D10: D3.31(I/O10)
EXT_D11: D3.32(I/O11)
EXT_D12: D3.35(I/O12)
EXT_D13: D3.36(I/O13)
EXT_D14: D3.37(I/O14)
EXT_D15: D3.38(I/O15)
EXT_GND: X178.1 XS1.74
EXT_RXD: X180.1 XS1.76
Ext_SWT_RS232_Rx: N41.1 N42.1 XS1.57
EXT_TXD: X179.1 XS1.75
GNDgd: N1.1 N2.1 XP13.4
INTERLOCK: N65.1 N66.1 R35.1
KORPUS: X226.1
M_GOTOV: N59.1 N60.1
M_PUSK: N63.1 N64.1
M_SPUSKI: N61.1 N62.1
MC1N: N69.1 N70.1
MC1P: N67.1 N68.1
MC2N: N73.1 N74.1 X228.1
MC2P: N71.1 N72.1 X227.1
RESET: N33.1 N34.1 XP14.10 XS1.45
RS232_ETH_RX: N43.1 N44.1 XS1.11
RS232_ETH_TX: N45.1 N46.1 XS1.12
SWT_RS232_Rx: N47.1 N48.1 XS1.56
TCK: N23.1 N24.1 R30.1 XP14.1 XS1.40
TDI: N25.1 N26.1 R31.1 XP14.2 XS1.41
TDO: N27.1 N28.1 R32.1 XP14.3 XS1.42
TMS: N29.1 N30.1 R33.1 XP14.4 XS1.43
TRST: N31.1 N32.1 R34.1 XP14.5 XS1.44
VKL_BU: VD5.3 XP13.1

Not connected (* = marked no-connect by the designer): XP13 10; XP14 6 9; XS1 1 2 3 4 5 6 7 8 13 14 15 16 17 18 19 20 46 47 48 49 50 51 52 58 59 63 64 65 77 78

### Notes on the sheet
- +27В БС
- TCK
- +27В внутр.
- GNDgd
- GND
- TDI
- TDO
- TMS
- +1.2V
- +3.3V
- TRST
- +5Vgd
- +5VEth
- +5V
- VCC
- RESET
- Сброс
- Общий
- Загрузчик RX
- Vcc
- Подп. и дата
- Загрузчик TX
- CAN-H
- Button_pin
- CAN-L
- +5VEthernet
- SWT_RS232
- Ext_SWT
- Инв. № дубл.
- Eth 4+
- Eth 4-
- Eth 3+
- Eth 3-
- Eth 2+
- Взам. инв. №
- Eth 2-
- Eth 1+
- Eth 1-
- Инв. № подл.
- Изм.
- Лист
- № докум.
- Подп.
- Дата
- Копировал
- Формат А3
- (in symbol ARM10PIN_КОНТ) Цепь; Конт.
- (in symbol CY62136EV30) SRAM
- (in symbol PBS-10(R)) Конт.; Цепь
- (in symbol ВИЛКА DS1077-78M, part A) Цепь; Контакт
- (in symbol ВИЛКА DS1077-78M, part C) Цепь; Контакт
- (in symbol ВИЛКА DS1077-78M, part D) Цепь; Контакт

### Library data of the parts
D3 = CY62136EV30: СОЗУ CY62136EV30 256КБ; TypePrefix: Статическая память; TUHolder: "Cypress Semiconductor",США; Prefix: D; Value: 256 КБ; PartNumber: CY62136EV30; TU: *
N1-N74 X164-X228 = CONT: CONT1_SMD; PartNumber: контактное поле; Value: *
R30-R34 = Р1-12_47k: Постоянные непроволочные безвыводные резисторы общего применения Р1-12; PartNumber: Р1-12-*-*±*%-*; TU: АЛЯР.434110.005 ТУ; TUHolder: ЗАО "РЕОМ"; TypePrefix: R; PackegeType: *; Value: *
R35 = Р1-12_10k: Постоянные непроволочные безвыводные резисторы общего применения Р1-12; PartNumber: Р1-12-*-*±*%-*; TU: АЛЯР.434110.005 ТУ; TUHolder: ЗАО "РЕОМ"; TypePrefix: R; PackegeType: *; Value: *
VD5 = 2Д707АС9: as VD4 on sheet ExternalConnection; Value: *; PartNumber: 2Д707АС9
XP13 = PBS-10(R): Value: B10B-PUDSS-1, JST (JAPAN SOLDERLESS TERMINALS)
XP14 = ARM10PIN_КОНТ: Value: Вилка СНП346-10ВП21-2В; TU: РЮМК.430420.011ТУ
XS1 = ВИЛКА DS1077-78M: Value: DS1077-78FB8(0)TSS, Connfly Electronic

## Sheet MCU1.SchDoc
size 420 x 297 mm; Address1: Address1; Address2: Address2; Address3: Address3; Address4: Address4; SheetNumber: 3; SheetTotal: 5; Scale: 1:1; DocumentType: Схема электрическая принципиальная
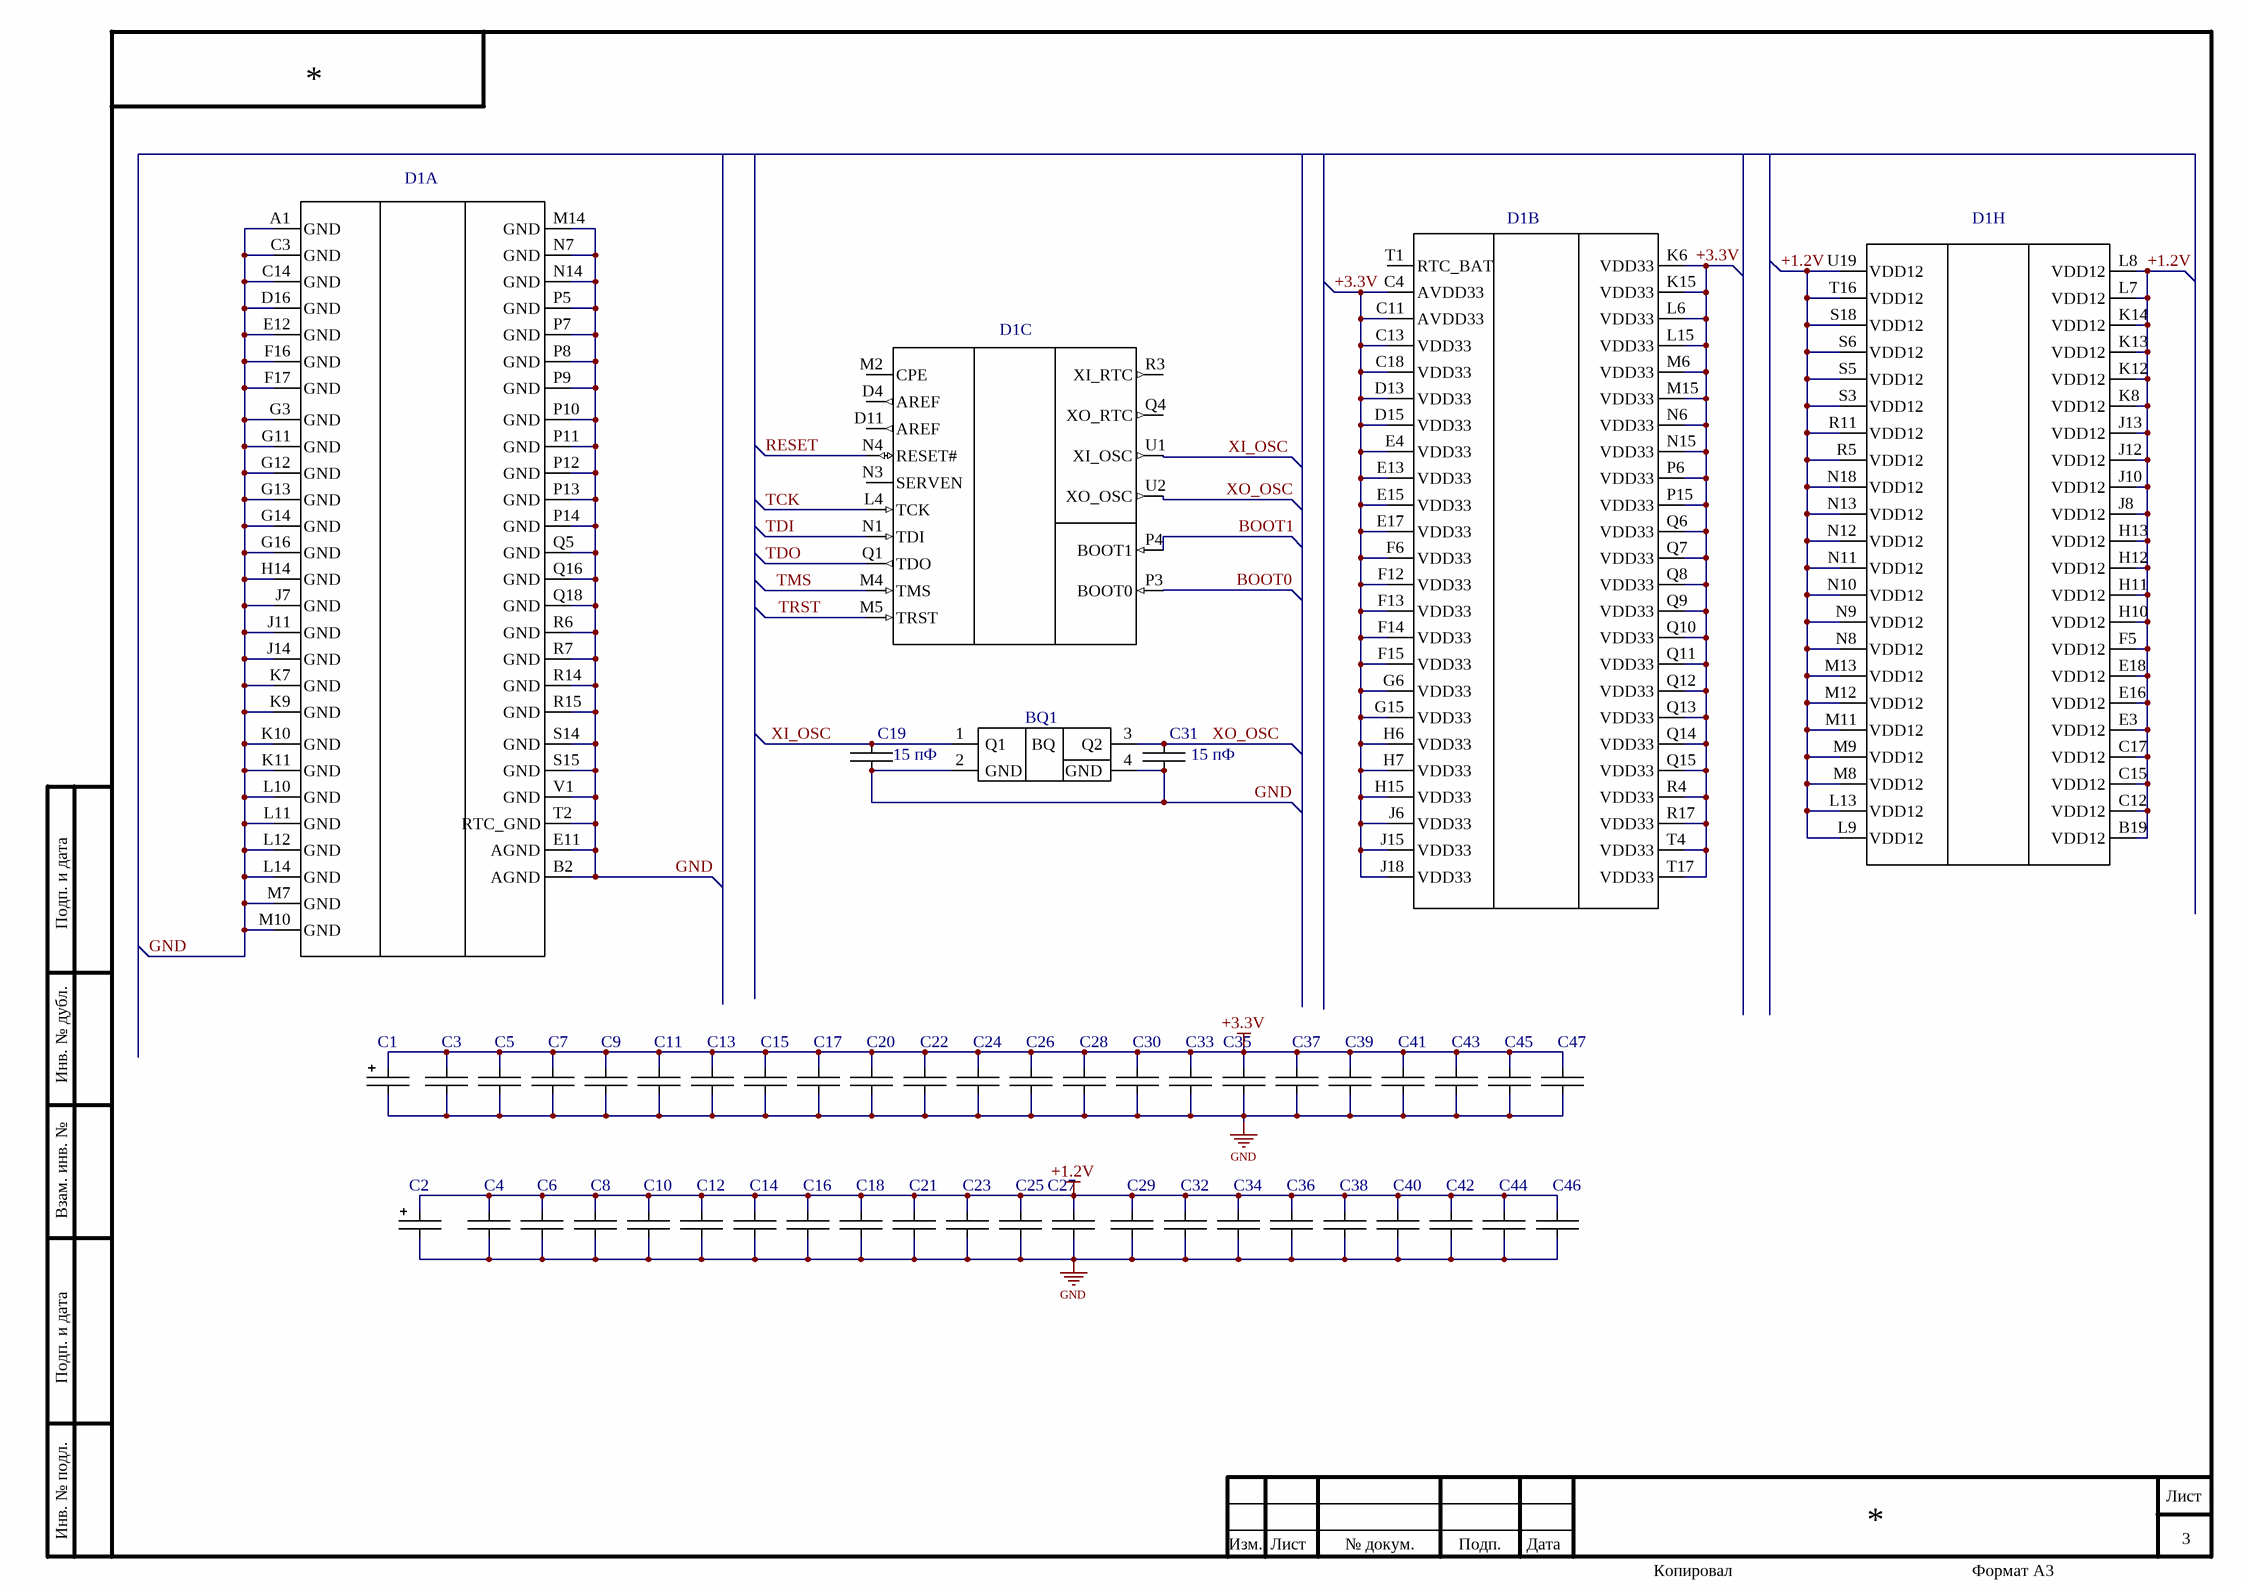
[diagram p2: MCU1.SchDoc]

### Parts
BQ1  Резонатор РК463-5ДС-16,0М  [RK463_BQ_RK-463(Primary)]  (value not drawn)
C1  22 мкФ  [К53-67]  (value not drawn)
C2  22 мкФ  [К53-67]  (value not drawn)
C3  0.1 мкФ  [C0805]  (value not drawn)
C4  0.1 мкФ  [C0805]  (value not drawn)
C5  0.1 мкФ  [C0805]  (value not drawn)
C6  0.1 мкФ  [C0805]  (value not drawn)
C7  0.1 мкФ  [C0805]  (value not drawn)
C8  0.1 мкФ  [C0805]  (value not drawn)
C9  0.1 мкФ  [C0805]  (value not drawn)
C10  0.1 мкФ  [C0805]  (value not drawn)
C11  0.1 мкФ  [C0805]  (value not drawn)
C12  0.1 мкФ  [C0805]  (value not drawn)
C13  0.1 мкФ  [C0805]  (value not drawn)
C14  0.1 мкФ  [C0805]  (value not drawn)
C15  0.1 мкФ  [C0805]  (value not drawn)
C16  0.1 мкФ  [C0805]  (value not drawn)
C17  0.1 мкФ  [C0805]  (value not drawn)
C18  0.1 мкФ  [C0805]  (value not drawn)
C19  15 пФ  [C0805]
C20  0.1 мкФ  [C0805]  (value not drawn)
C21  0.1 мкФ  [C0805]  (value not drawn)
C22  0.1 мкФ  [C0805]  (value not drawn)
C23  0.1 мкФ  [C0805]  (value not drawn)
C24  0.1 мкФ  [C0805]  (value not drawn)
C25  0.1 мкФ  [C0805]  (value not drawn)
C26  0.1 мкФ  [C0805]  (value not drawn)
C27  0.1 мкФ  [C0805]  (value not drawn)
C28  0.1 мкФ  [C0805]  (value not drawn)
C29  0.1 мкФ  [C0805]  (value not drawn)
C30  0.1 мкФ  [C0805]  (value not drawn)
C31  15 пФ  [C0805]
C32  0.1 мкФ  [C0805]  (value not drawn)
C33  0.1 мкФ  [C0805]  (value not drawn)
C34  0.1 мкФ  [C0805]  (value not drawn)
C35  0.1 мкФ  [C0805]  (value not drawn)
C36  0.1 мкФ  [C0805]  (value not drawn)
C37  0.1 мкФ  [C0805]  (value not drawn)
C38  0.1 мкФ  [C0805]  (value not drawn)
C39  0.1 мкФ  [C0805]  (value not drawn)
C40  0.1 мкФ  [C0805]  (value not drawn)
C41  0.1 мкФ  [C0805]  (value not drawn)
C42  0.1 мкФ  [C0805]  (value not drawn)
C43  0.1 мкФ  [C0805]  (value not drawn)
C44  0.1 мкФ  [C0805]  (value not drawn)
C45  0.1 мкФ  [C0805]  (value not drawn)
C46  0.1 мкФ  [C0805]  (value not drawn)
C47  0.1 мкФ  [C0805]  (value not drawn)
D1  1921ВК028  [BGA-400_21.0X21.0MM_LAYOUT20X20_P1.0MM]  (value not drawn)  (parts A,B,C,H of 8)

### Nets
+1.2V: C2.1 C4.1 C6.1 C8.1 C10.1 C12.1 C14.1 C16.1 C18.1 C21.1 C23.1 C25.1 C27.1 C29.1 C32.1 C34.1 C36.1 C38.1 C40.1 C42.1 C44.1 C46.1 D1.B19(VDD12) D1.C12(VDD12) D1.C15(VDD12) D1.C17(VDD12) D1.E3(VDD12) D1.E16(VDD12) D1.E18(VDD12) D1.F5(VDD12) D1.H10(VDD12) D1.H11(VDD12) D1.H12(VDD12) D1.H13(VDD12) D1.J8(VDD12) D1.J10(VDD12) D1.J12(VDD12) D1.J13(VDD12) D1.K8(VDD12) D1.K12(VDD12) D1.K13(VDD12) D1.K14(VDD12) D1.L7(VDD12) D1.L8(VDD12) D1.L9(VDD12) D1.L13(VDD12) D1.M8(VDD12) D1.M9(VDD12) D1.M11(VDD12) D1.M12(VDD12) D1.M13(VDD12) D1.N8(VDD12) D1.N9(VDD12) D1.N10(VDD12) D1.N11(VDD12) D1.N12(VDD12) D1.N13(VDD12) D1.N18(VDD12) D1.R5(VDD12) D1.R11(VDD12) D1.S3(VDD12) D1.S5(VDD12) D1.S6(VDD12) D1.S18(VDD12) D1.T16(VDD12) D1.U19(VDD12)
+3.3V: C1.1 C3.1 C5.1 C7.1 C9.1 C11.1 C13.1 C15.1 C17.1 C20.1 C22.1 C24.1 C26.1 C28.1 C30.1 C33.1 C35.1 C37.1 C39.1 C41.1 C43.1 C45.1 C47.1 D1.C4(AVDD33) D1.C11(AVDD33) D1.C13(VDD33) D1.C18(VDD33) D1.D13(VDD33) D1.D15(VDD33) D1.E4(VDD33) D1.E13(VDD33) D1.E15(VDD33) D1.E17(VDD33) D1.F6(VDD33) D1.F12(VDD33) D1.F13(VDD33) D1.F14(VDD33) D1.F15(VDD33) D1.G6(VDD33) D1.G15(VDD33) D1.H6(VDD33) D1.H7(VDD33) D1.H15(VDD33) D1.J6(VDD33) D1.J15(VDD33) D1.J18(VDD33) D1.K6(VDD33) D1.K15(VDD33) D1.L6(VDD33) D1.L15(VDD33) D1.M6(VDD33) D1.M15(VDD33) D1.N6(VDD33) D1.N15(VDD33) D1.P6(VDD33) D1.P15(VDD33) D1.Q6(VDD33) D1.Q7(VDD33) D1.Q8(VDD33) D1.Q9(VDD33) D1.Q10(VDD33) D1.Q11(VDD33) D1.Q12(VDD33) D1.Q13(VDD33) D1.Q14(VDD33) D1.Q15(VDD33) D1.R4(VDD33) D1.R17(VDD33) D1.T4(VDD33) D1.T17(VDD33)
GND: BQ1.2(GND) BQ1.4(GND) C1.2 C2.2 C3.2 C4.2 C5.2 C6.2 C7.2 C8.2 C9.2 C10.2 C11.2 C12.2 C13.2 C14.2 C15.2 C16.2 C17.2 C18.2 C19.2 C20.2 C21.2 C22.2 C23.2 C24.2 C25.2 C26.2 C27.2 C28.2 C29.2 C30.2 C31.2 C32.2 C33.2 C34.2 C35.2 C36.2 C37.2 C38.2 C39.2 C40.2 C41.2 C42.2 C43.2 C44.2 C45.2 C46.2 C47.2 D1.A1(GND) D1.B2(AGND) D1.C3(GND) D1.C14(GND) D1.D16(GND) D1.E11(AGND) D1.E12(GND) D1.F16(GND) D1.F17(GND) D1.G3(GND) D1.G11(GND) D1.G12(GND) D1.G13(GND) D1.G14(GND) D1.G16(GND) D1.H14(GND) D1.J7(GND) D1.J11(GND) D1.J14(GND) D1.K7(GND) D1.K9(GND) D1.K10(GND) D1.K11(GND) D1.L10(GND) D1.L11(GND) D1.L12(GND) D1.L14(GND) D1.M7(GND) D1.M10(GND) D1.M14(GND) D1.N7(GND) D1.N14(GND) D1.P5(GND) D1.P7(GND) D1.P8(GND) D1.P9(GND) D1.P10(GND) D1.P11(GND) D1.P12(GND) D1.P13(GND) D1.P14(GND) D1.Q5(GND) D1.Q16(GND) D1.Q18(GND) D1.R6(GND) D1.R7(GND) D1.R14(GND) D1.R15(GND) D1.S14(GND) D1.S15(GND) D1.T2(RTC_GND) D1.V1(GND)
BOOT0: D1.P3(BOOT0)
BOOT1: D1.P4(BOOT1)
RESET: D1.N4(RESET#)
TCK: D1.L4(TCK)
TDI: D1.N1(TDI)
TDO: D1.Q1(TDO)
TMS: D1.M4(TMS)
TRST: D1.M5(TRST)
XI_OSC: BQ1.1(Q1) C19.1 D1.U1(XI_OSC)
XO_OSC: BQ1.3(Q2) C31.1 D1.U2(XO_OSC)

Not connected (* = marked no-connect by the designer): D1 D4(AREF) D11(AREF) M2(CPE) N3(SERVEN) Q4(XO_RTC) R3(XI_RTC) T1(RTC_BAT)

### Notes on the sheet
- Подп. и дата
- Инв. № дубл.
- Взам. инв. №
- Инв. № подл.
- Изм.
- Лист
- № докум.
- Подп.
- Дата
- Копировал
- Формат А3

### Library data of the parts
BQ1 = РК463-5ДС: Кварцевый резонатор; TU: ТУ6321-011-07604008-07; TUHolder: "Пьезотрон"; TypePrefix: BQ; PartNumber: Резонатор РК463-5ДС-16,0М
C1 C2 = К53-67: Оксидно-полупроводниковый танталовый чип-конденсатор серии К53-68; PartNumber: К53-67 "*"-* В-* мкФ ±*%; TypePrefix: C; TU: АЖЯР.673546.006 ТУ; TUHolder: ОАО НИИ "ГИРИКОНД"; Value: *; PackegeType: *
C3-C18 C20-C30 C32-C47 = К10-69_0.1mk: Керамический чип-конденсатор серии К10-69; PartNumber: К10-69в-*-* В- * ± *% *; TypePrefix: C; TU: АЖЯР.673511.002ТУ; TUHolder: ОАО НИИ "ГИРИКОНД"; Value: *; PackegeType: *
C19 C31 = К10-69в_15p: Конденсатор неполярный
D1 = 1921ВК028: МК 1921ВК028; TypePrefix: Микроконтроллер; TU: АЕНВ.431290.444ТУ; TUHolder: АО «НИИЭТ», Россия, г.Воронеж; Prefix: D; TypeName: Микросхемы интегральные; Value: *; PartNumber: 1921ВК028

## Sheet MCU2.SchDoc
size 420 x 297 mm; Address1: Address1; Address2: Address2; Address3: Address3; Address4: Address4; SheetNumber: 4; SheetTotal: 5; Scale: 1:1; DocumentType: Схема электрическая принципиальная
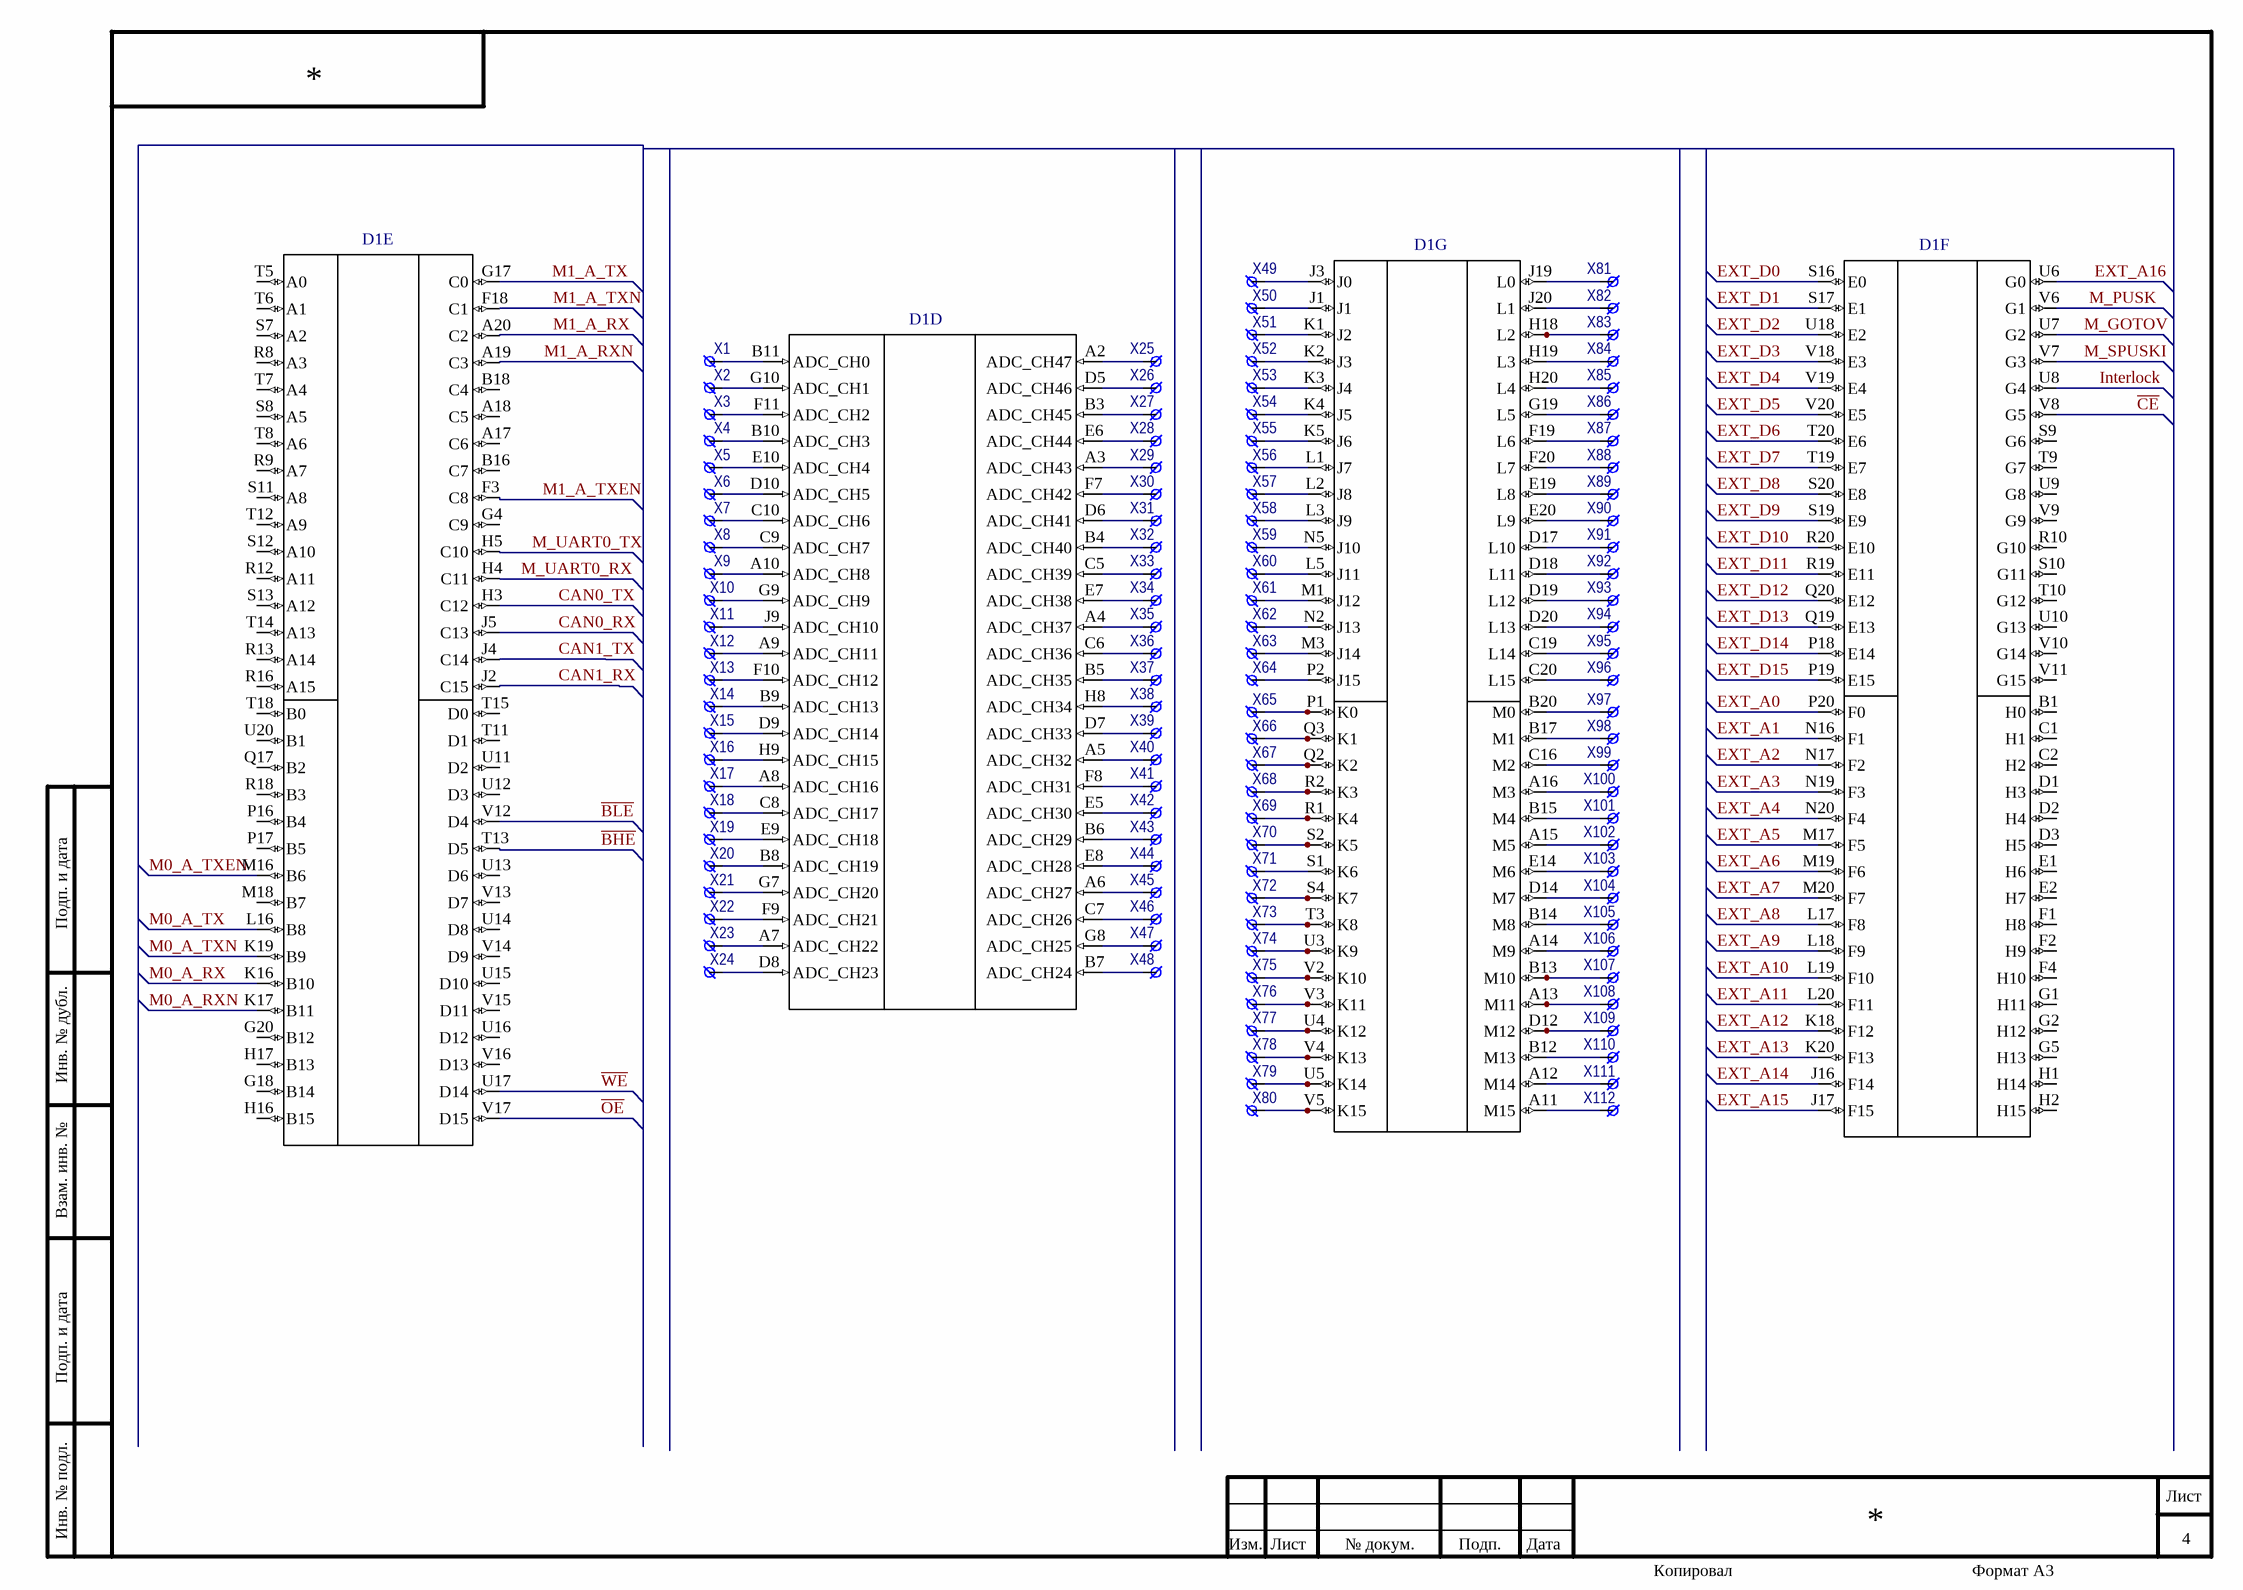
[diagram p3: MCU2.SchDoc]

### Parts
D1  1921ВК028  [BGA-400_21.0X21.0MM_LAYOUT20X20_P1.0MM]  (value not drawn)  (parts D,E,F,G of 8)
X1  CONT  [ПЛАН_ПЛОЩ]  (value not drawn)
X2  CONT  [ПЛАН_ПЛОЩ]  (value not drawn)
X3  CONT  [ПЛАН_ПЛОЩ]  (value not drawn)
X4  CONT  [ПЛАН_ПЛОЩ]  (value not drawn)
X5  CONT  [ПЛАН_ПЛОЩ]  (value not drawn)
X6  CONT  [ПЛАН_ПЛОЩ]  (value not drawn)
X7  CONT  [ПЛАН_ПЛОЩ]  (value not drawn)
X8  CONT  [ПЛАН_ПЛОЩ]  (value not drawn)
X9  CONT  [ПЛАН_ПЛОЩ]  (value not drawn)
X10  CONT  [ПЛАН_ПЛОЩ]  (value not drawn)
X11  CONT  [ПЛАН_ПЛОЩ]  (value not drawn)
X12  CONT  [ПЛАН_ПЛОЩ]  (value not drawn)
X13  CONT  [ПЛАН_ПЛОЩ]  (value not drawn)
X14  CONT  [ПЛАН_ПЛОЩ]  (value not drawn)
X15  CONT  [ПЛАН_ПЛОЩ]  (value not drawn)
X16  CONT  [ПЛАН_ПЛОЩ]  (value not drawn)
X17  CONT  [ПЛАН_ПЛОЩ]  (value not drawn)
X18  CONT  [ПЛАН_ПЛОЩ]  (value not drawn)
X19  CONT  [ПЛАН_ПЛОЩ]  (value not drawn)
X20  CONT  [ПЛАН_ПЛОЩ]  (value not drawn)
X21  CONT  [ПЛАН_ПЛОЩ]  (value not drawn)
X22  CONT  [ПЛАН_ПЛОЩ]  (value not drawn)
X23  CONT  [ПЛАН_ПЛОЩ]  (value not drawn)
X24  CONT  [ПЛАН_ПЛОЩ]  (value not drawn)
X25  CONT  [ПЛАН_ПЛОЩ]  (value not drawn)
X26  CONT  [ПЛАН_ПЛОЩ]  (value not drawn)
X27  CONT  [ПЛАН_ПЛОЩ]  (value not drawn)
X28  CONT  [ПЛАН_ПЛОЩ]  (value not drawn)
X29  CONT  [ПЛАН_ПЛОЩ]  (value not drawn)
X30  CONT  [ПЛАН_ПЛОЩ]  (value not drawn)
X31  CONT  [ПЛАН_ПЛОЩ]  (value not drawn)
X32  CONT  [ПЛАН_ПЛОЩ]  (value not drawn)
X33  CONT  [ПЛАН_ПЛОЩ]  (value not drawn)
X34  CONT  [ПЛАН_ПЛОЩ]  (value not drawn)
X35  CONT  [ПЛАН_ПЛОЩ]  (value not drawn)
X36  CONT  [ПЛАН_ПЛОЩ]  (value not drawn)
X37  CONT  [ПЛАН_ПЛОЩ]  (value not drawn)
X38  CONT  [ПЛАН_ПЛОЩ]  (value not drawn)
X39  CONT  [ПЛАН_ПЛОЩ]  (value not drawn)
X40  CONT  [ПЛАН_ПЛОЩ]  (value not drawn)
X41  CONT  [ПЛАН_ПЛОЩ]  (value not drawn)
X42  CONT  [ПЛАН_ПЛОЩ]  (value not drawn)
X43  CONT  [ПЛАН_ПЛОЩ]  (value not drawn)
X44  CONT  [ПЛАН_ПЛОЩ]  (value not drawn)
X45  CONT  [ПЛАН_ПЛОЩ]  (value not drawn)
X46  CONT  [ПЛАН_ПЛОЩ]  (value not drawn)
X47  CONT  [ПЛАН_ПЛОЩ]  (value not drawn)
X48  CONT  [ПЛАН_ПЛОЩ]  (value not drawn)
X49  CONT  [ПЛАН_ПЛОЩ]  (value not drawn)
X50  CONT  [ПЛАН_ПЛОЩ]  (value not drawn)
X51  CONT  [ПЛАН_ПЛОЩ]  (value not drawn)
X52  CONT  [ПЛАН_ПЛОЩ]  (value not drawn)
X53  CONT  [ПЛАН_ПЛОЩ]  (value not drawn)
X54  CONT  [ПЛАН_ПЛОЩ]  (value not drawn)
X55  CONT  [ПЛАН_ПЛОЩ]  (value not drawn)
X56  CONT  [ПЛАН_ПЛОЩ]  (value not drawn)
X57  CONT  [ПЛАН_ПЛОЩ]  (value not drawn)
X58  CONT  [ПЛАН_ПЛОЩ]  (value not drawn)
X59  CONT  [ПЛАН_ПЛОЩ]  (value not drawn)
X60  CONT  [ПЛАН_ПЛОЩ]  (value not drawn)
X61  CONT  [ПЛАН_ПЛОЩ]  (value not drawn)
X62  CONT  [ПЛАН_ПЛОЩ]  (value not drawn)
X63  CONT  [ПЛАН_ПЛОЩ]  (value not drawn)
X64  CONT  [ПЛАН_ПЛОЩ]  (value not drawn)
X65  CONT  [ПЛАН_ПЛОЩ]  (value not drawn)
X66  CONT  [ПЛАН_ПЛОЩ]  (value not drawn)
X67  CONT  [ПЛАН_ПЛОЩ]  (value not drawn)
X68  CONT  [ПЛАН_ПЛОЩ]  (value not drawn)
X69  CONT  [ПЛАН_ПЛОЩ]  (value not drawn)
X70  CONT  [ПЛАН_ПЛОЩ]  (value not drawn)
X71  CONT  [ПЛАН_ПЛОЩ]  (value not drawn)
X72  CONT  [ПЛАН_ПЛОЩ]  (value not drawn)
X73  CONT  [ПЛАН_ПЛОЩ]  (value not drawn)
X74  CONT  [ПЛАН_ПЛОЩ]  (value not drawn)
X75  CONT  [ПЛАН_ПЛОЩ]  (value not drawn)
X76  CONT  [ПЛАН_ПЛОЩ]  (value not drawn)
X77  CONT  [ПЛАН_ПЛОЩ]  (value not drawn)
X78  CONT  [ПЛАН_ПЛОЩ]  (value not drawn)
X79  CONT  [ПЛАН_ПЛОЩ]  (value not drawn)
X80  CONT  [ПЛАН_ПЛОЩ]  (value not drawn)
X81  CONT  [ПЛАН_ПЛОЩ]  (value not drawn)
X82  CONT  [ПЛАН_ПЛОЩ]  (value not drawn)
X83  CONT  [ПЛАН_ПЛОЩ]  (value not drawn)
X84  CONT  [ПЛАН_ПЛОЩ]  (value not drawn)
X85  CONT  [ПЛАН_ПЛОЩ]  (value not drawn)
X86  CONT  [ПЛАН_ПЛОЩ]  (value not drawn)
X87  CONT  [ПЛАН_ПЛОЩ]  (value not drawn)
X88  CONT  [ПЛАН_ПЛОЩ]  (value not drawn)
X89  CONT  [ПЛАН_ПЛОЩ]  (value not drawn)
X90  CONT  [ПЛАН_ПЛОЩ]  (value not drawn)
X91  CONT  [ПЛАН_ПЛОЩ]  (value not drawn)
X92  CONT  [ПЛАН_ПЛОЩ]  (value not drawn)
X93  CONT  [ПЛАН_ПЛОЩ]  (value not drawn)
X94  CONT  [ПЛАН_ПЛОЩ]  (value not drawn)
X95  CONT  [ПЛАН_ПЛОЩ]  (value not drawn)
X96  CONT  [ПЛАН_ПЛОЩ]  (value not drawn)
X97  CONT  [ПЛАН_ПЛОЩ]  (value not drawn)
X98  CONT  [ПЛАН_ПЛОЩ]  (value not drawn)
X99  CONT  [ПЛАН_ПЛОЩ]  (value not drawn)
X100  CONT  [ПЛАН_ПЛОЩ]  (value not drawn)
X101  CONT  [ПЛАН_ПЛОЩ]  (value not drawn)
X102  CONT  [ПЛАН_ПЛОЩ]  (value not drawn)
X103  CONT  [ПЛАН_ПЛОЩ]  (value not drawn)
X104  CONT  [ПЛАН_ПЛОЩ]  (value not drawn)
X105  CONT  [ПЛАН_ПЛОЩ]  (value not drawn)
X106  CONT  [ПЛАН_ПЛОЩ]  (value not drawn)
X107  CONT  [ПЛАН_ПЛОЩ]  (value not drawn)
X108  CONT  [ПЛАН_ПЛОЩ]  (value not drawn)
X109  CONT  [ПЛАН_ПЛОЩ]  (value not drawn)
X110  CONT  [ПЛАН_ПЛОЩ]  (value not drawn)
X111  CONT  [ПЛАН_ПЛОЩ]  (value not drawn)
X112  CONT  [ПЛАН_ПЛОЩ]  (value not drawn)

### Nets
~{BHE}: D1.T13(D5)
~{BLE}: D1.V12(D4)
~{CE}: D1.V8(G5)
~{OE}: D1.V17(D15)
~{WE}: D1.U17(D14)
CAN0_RX: D1.J5(C13)
CAN0_TX: D1.H3(C12)
CAN1_RX: D1.J2(C15)
CAN1_TX: D1.J4(C14)
EXT_A0: D1.P20(F0)
EXT_A1: D1.N16(F1)
EXT_A2: D1.N17(F2)
EXT_A3: D1.N19(F3)
EXT_A4: D1.N20(F4)
EXT_A5: D1.M17(F5)
EXT_A6: D1.M19(F6)
EXT_A7: D1.M20(F7)
EXT_A8: D1.L17(F8)
EXT_A9: D1.L18(F9)
EXT_A10: D1.L19(F10)
EXT_A11: D1.L20(F11)
EXT_A12: D1.K18(F12)
EXT_A13: D1.K20(F13)
EXT_A14: D1.J16(F14)
EXT_A15: D1.J17(F15)
EXT_A16: D1.U6(G0)
EXT_D0: D1.S16(E0)
EXT_D1: D1.S17(E1)
EXT_D2: D1.U18(E2)
EXT_D3: D1.V18(E3)
EXT_D4: D1.V19(E4)
EXT_D5: D1.V20(E5)
EXT_D6: D1.T20(E6)
EXT_D7: D1.T19(E7)
EXT_D8: D1.S20(E8)
EXT_D9: D1.S19(E9)
EXT_D10: D1.R20(E10)
EXT_D11: D1.R19(E11)
EXT_D12: D1.Q20(E12)
EXT_D13: D1.Q19(E13)
EXT_D14: D1.P18(E14)
EXT_D15: D1.P19(E15)
INTERLOCK: D1.U8(G4)
M0_A_RX: D1.K16(B10)
M0_A_RXN: D1.K17(B11)
M0_A_TX: D1.L16(B8)
M0_A_TXEN: D1.M16(B6)
M0_A_TXN: D1.K19(B9)
M1_A_RX: D1.A20(C2)
M1_A_RXN: D1.A19(C3)
M1_A_TX: D1.G17(C0)
M1_A_TXEN: D1.F3(C8)
M1_A_TXN: D1.F18(C1)
M_GOTOV: D1.U7(G2)
M_PUSK: D1.V6(G1)
M_SPUSKI: D1.V7(G3)
M_UART0_RX: D1.H4(C11)
M_UART0_TX: D1.H5(C10)
NetD1_A2: D1.A2(ADC_CH47) X25.1
NetD1_A3: D1.A3(ADC_CH43) X29.1
NetD1_A4: D1.A4(ADC_CH37) X35.1
NetD1_A5: D1.A5(ADC_CH32) X40.1
NetD1_A6: D1.A6(ADC_CH27) X45.1
NetD1_A7: D1.A7(ADC_CH22) X23.1
NetD1_A8: D1.A8(ADC_CH16) X17.1
NetD1_A9: D1.A9(ADC_CH11) X12.1
NetD1_A10: D1.A10(ADC_CH8) X9.1
NetD1_A11: D1.A11(M15) X112.1
NetD1_A12: D1.A12(M14) X111.1
NetD1_A13: D1.A13(M11) X108.1
NetD1_A14: D1.A14(M9) X106.1
NetD1_A15: D1.A15(M5) X102.1
NetD1_A16: D1.A16(M3) X100.1
NetD1_B3: D1.B3(ADC_CH45) X27.1
NetD1_B4: D1.B4(ADC_CH40) X32.1
NetD1_B5: D1.B5(ADC_CH35) X37.1
NetD1_B6: D1.B6(ADC_CH29) X43.1
NetD1_B7: D1.B7(ADC_CH24) X48.1
NetD1_B8: D1.B8(ADC_CH19) X20.1
NetD1_B9: D1.B9(ADC_CH13) X14.1
NetD1_B10: D1.B10(ADC_CH3) X4.1
NetD1_B11: D1.B11(ADC_CH0) X1.1
NetD1_B12: D1.B12(M13) X110.1
NetD1_B13: D1.B13(M10) X107.1
NetD1_B14: D1.B14(M8) X105.1
NetD1_B15: D1.B15(M4) X101.1
NetD1_B17: D1.B17(M1) X98.1
NetD1_B20: D1.B20(M0) X97.1
NetD1_C5: D1.C5(ADC_CH39) X33.1
NetD1_C6: D1.C6(ADC_CH36) X36.1
NetD1_C7: D1.C7(ADC_CH26) X46.1
NetD1_C8: D1.C8(ADC_CH17) X18.1
NetD1_C9: D1.C9(ADC_CH7) X8.1
NetD1_C10: D1.C10(ADC_CH6) X7.1
NetD1_C16: D1.C16(M2) X99.1
NetD1_C19: D1.C19(L14) X95.1
NetD1_C20: D1.C20(L15) X96.1
NetD1_D5: D1.D5(ADC_CH46) X26.1
NetD1_D6: D1.D6(ADC_CH41) X31.1
NetD1_D7: D1.D7(ADC_CH33) X39.1
NetD1_D8: D1.D8(ADC_CH23) X24.1
NetD1_D9: D1.D9(ADC_CH14) X15.1
NetD1_D10: D1.D10(ADC_CH5) X6.1
NetD1_D12: D1.D12(M12) X109.1
NetD1_D14: D1.D14(M7) X104.1
NetD1_D17: D1.D17(L10) X91.1
NetD1_D18: D1.D18(L11) X92.1
NetD1_D19: D1.D19(L12) X93.1
NetD1_D20: D1.D20(L13) X94.1
NetD1_E5: D1.E5(ADC_CH30) X42.1
NetD1_E6: D1.E6(ADC_CH44) X28.1
NetD1_E7: D1.E7(ADC_CH38) X34.1
NetD1_E8: D1.E8(ADC_CH28) X44.1
NetD1_E9: D1.E9(ADC_CH18) X19.1
NetD1_E10: D1.E10(ADC_CH4) X5.1
NetD1_E14: D1.E14(M6) X103.1
NetD1_E19: D1.E19(L8) X89.1
NetD1_E20: D1.E20(L9) X90.1
NetD1_F7: D1.F7(ADC_CH42) X30.1
NetD1_F8: D1.F8(ADC_CH31) X41.1
NetD1_F9: D1.F9(ADC_CH21) X22.1
NetD1_F10: D1.F10(ADC_CH12) X13.1
NetD1_F11: D1.F11(ADC_CH2) X3.1
NetD1_F19: D1.F19(L6) X87.1
NetD1_F20: D1.F20(L7) X88.1
NetD1_G7: D1.G7(ADC_CH20) X21.1
NetD1_G8: D1.G8(ADC_CH25) X47.1
NetD1_G9: D1.G9(ADC_CH9) X10.1
NetD1_G10: D1.G10(ADC_CH1) X2.1
NetD1_G19: D1.G19(L5) X86.1
NetD1_H8: D1.H8(ADC_CH34) X38.1
NetD1_H9: D1.H9(ADC_CH15) X16.1
NetD1_H18: D1.H18(L2) X83.1
NetD1_H19: D1.H19(L3) X84.1
NetD1_H20: D1.H20(L4) X85.1
NetD1_J1: D1.J1 X50.1
NetD1_J3: D1.J3(J0) X49.1
NetD1_J9: D1.J9(ADC_CH10) X11.1
NetD1_J19: D1.J19(L0) X81.1
NetD1_J20: D1.J20(L1) X82.1
NetD1_K1: D1.K1(J2) X51.1
NetD1_K2: D1.K2(J3) X52.1
NetD1_K3: D1.K3(J4) X53.1
NetD1_K4: D1.K4(J5) X54.1
NetD1_K5: D1.K5(J6) X55.1
NetD1_L1: D1.L1(J7) X56.1
NetD1_L2: D1.L2(J8) X57.1
NetD1_L3: D1.L3(J9) X58.1
NetD1_L5: D1.L5(J11) X60.1
NetD1_M1: D1.M1(J12) X61.1
NetD1_M3: D1.M3(J14) X63.1
NetD1_N2: D1.N2(J13) X62.1
NetD1_N5: D1.N5(J10) X59.1
NetD1_P1: D1.P1(K0) X65.1
NetD1_P2: D1.P2(J15) X64.1
NetD1_Q2: D1.Q2(K2) X67.1
NetD1_Q3: D1.Q3(K1) X66.1
NetD1_R1: D1.R1(K4) X69.1
NetD1_R2: D1.R2(K3) X68.1
NetD1_S1: D1.S1(K6) X71.1
NetD1_S2: D1.S2(K5) X70.1
NetD1_S4: D1.S4(K7) X72.1
NetD1_T3: D1.T3(K8) X73.1
NetD1_U3: D1.U3(K9) X74.1
NetD1_U4: D1.U4(K12) X77.1
NetD1_U5: D1.U5(K14) X79.1
NetD1_V2: D1.V2(K10) X75.1
NetD1_V3: D1.V3(K11) X76.1
NetD1_V4: D1.V4(K13) X78.1
NetD1_V5: D1.V5(K15) X80.1

Not connected (* = marked no-connect by the designer): D1 A17(C6) A18(C5) B1(H0) B16(C7) B18(C4) C1(H1) C2(H2) D1(H3) D2(H4) D3(H5) E1(H6) E2(H7) F1(H8) F2(H9) F4(H10) G1(H11) G2(H12) G4(C9) G5(H13) G18(B14) G20(B12) H1(H14) H2(H15) H16(B15) H17(B13) M18(B7) P16(B4) P17(B5) Q17(B2) R8(A3) R9(A7) R10(G10) R12(A11) R13(A14) R16(A15) R18(B3) S7(A2) S8(A5) S9(G6) S10(G11) S11(A8) S12(A10) S13(A12) T5(A0) T6(A1) T7(A4) T8(A6) T9(G7) T10(G12) T11(D1) T12(A9) T14(A13) T15(D0) T18(B0) U9(G8) U10(G13) U11(D2) U12(D3) U13(D6) U14(D8) U15(D10) U16(D12) U20(B1) V9(G9) V10(G14) V11(G15) V13(D7) V14(D9) V15(D11) V16(D13)

### Notes on the sheet
- Подп. и дата
- Инв. № дубл.
- Взам. инв. №
- Инв. № подл.
- Изм.
- Лист
- № докум.
- Подп.
- Дата
- Копировал
- Формат А3

### Library data of the parts
D1 = 1921ВК028: as D1 on sheet MCU1; Value: *; PartNumber: 1921ВК028
X1-X112 = CONT: CONT1_SMD; PartNumber: контактное поле; Value: *

## Sheet InterfMCU.SchDoc
size 420 x 297 mm; Address1: Address1; Address2: Address2; Address3: Address3; Address4: Address4; SheetNumber: 5; SheetTotal: 5; Scale: 1:1; DocumentType: Схема электрическая принципиальная
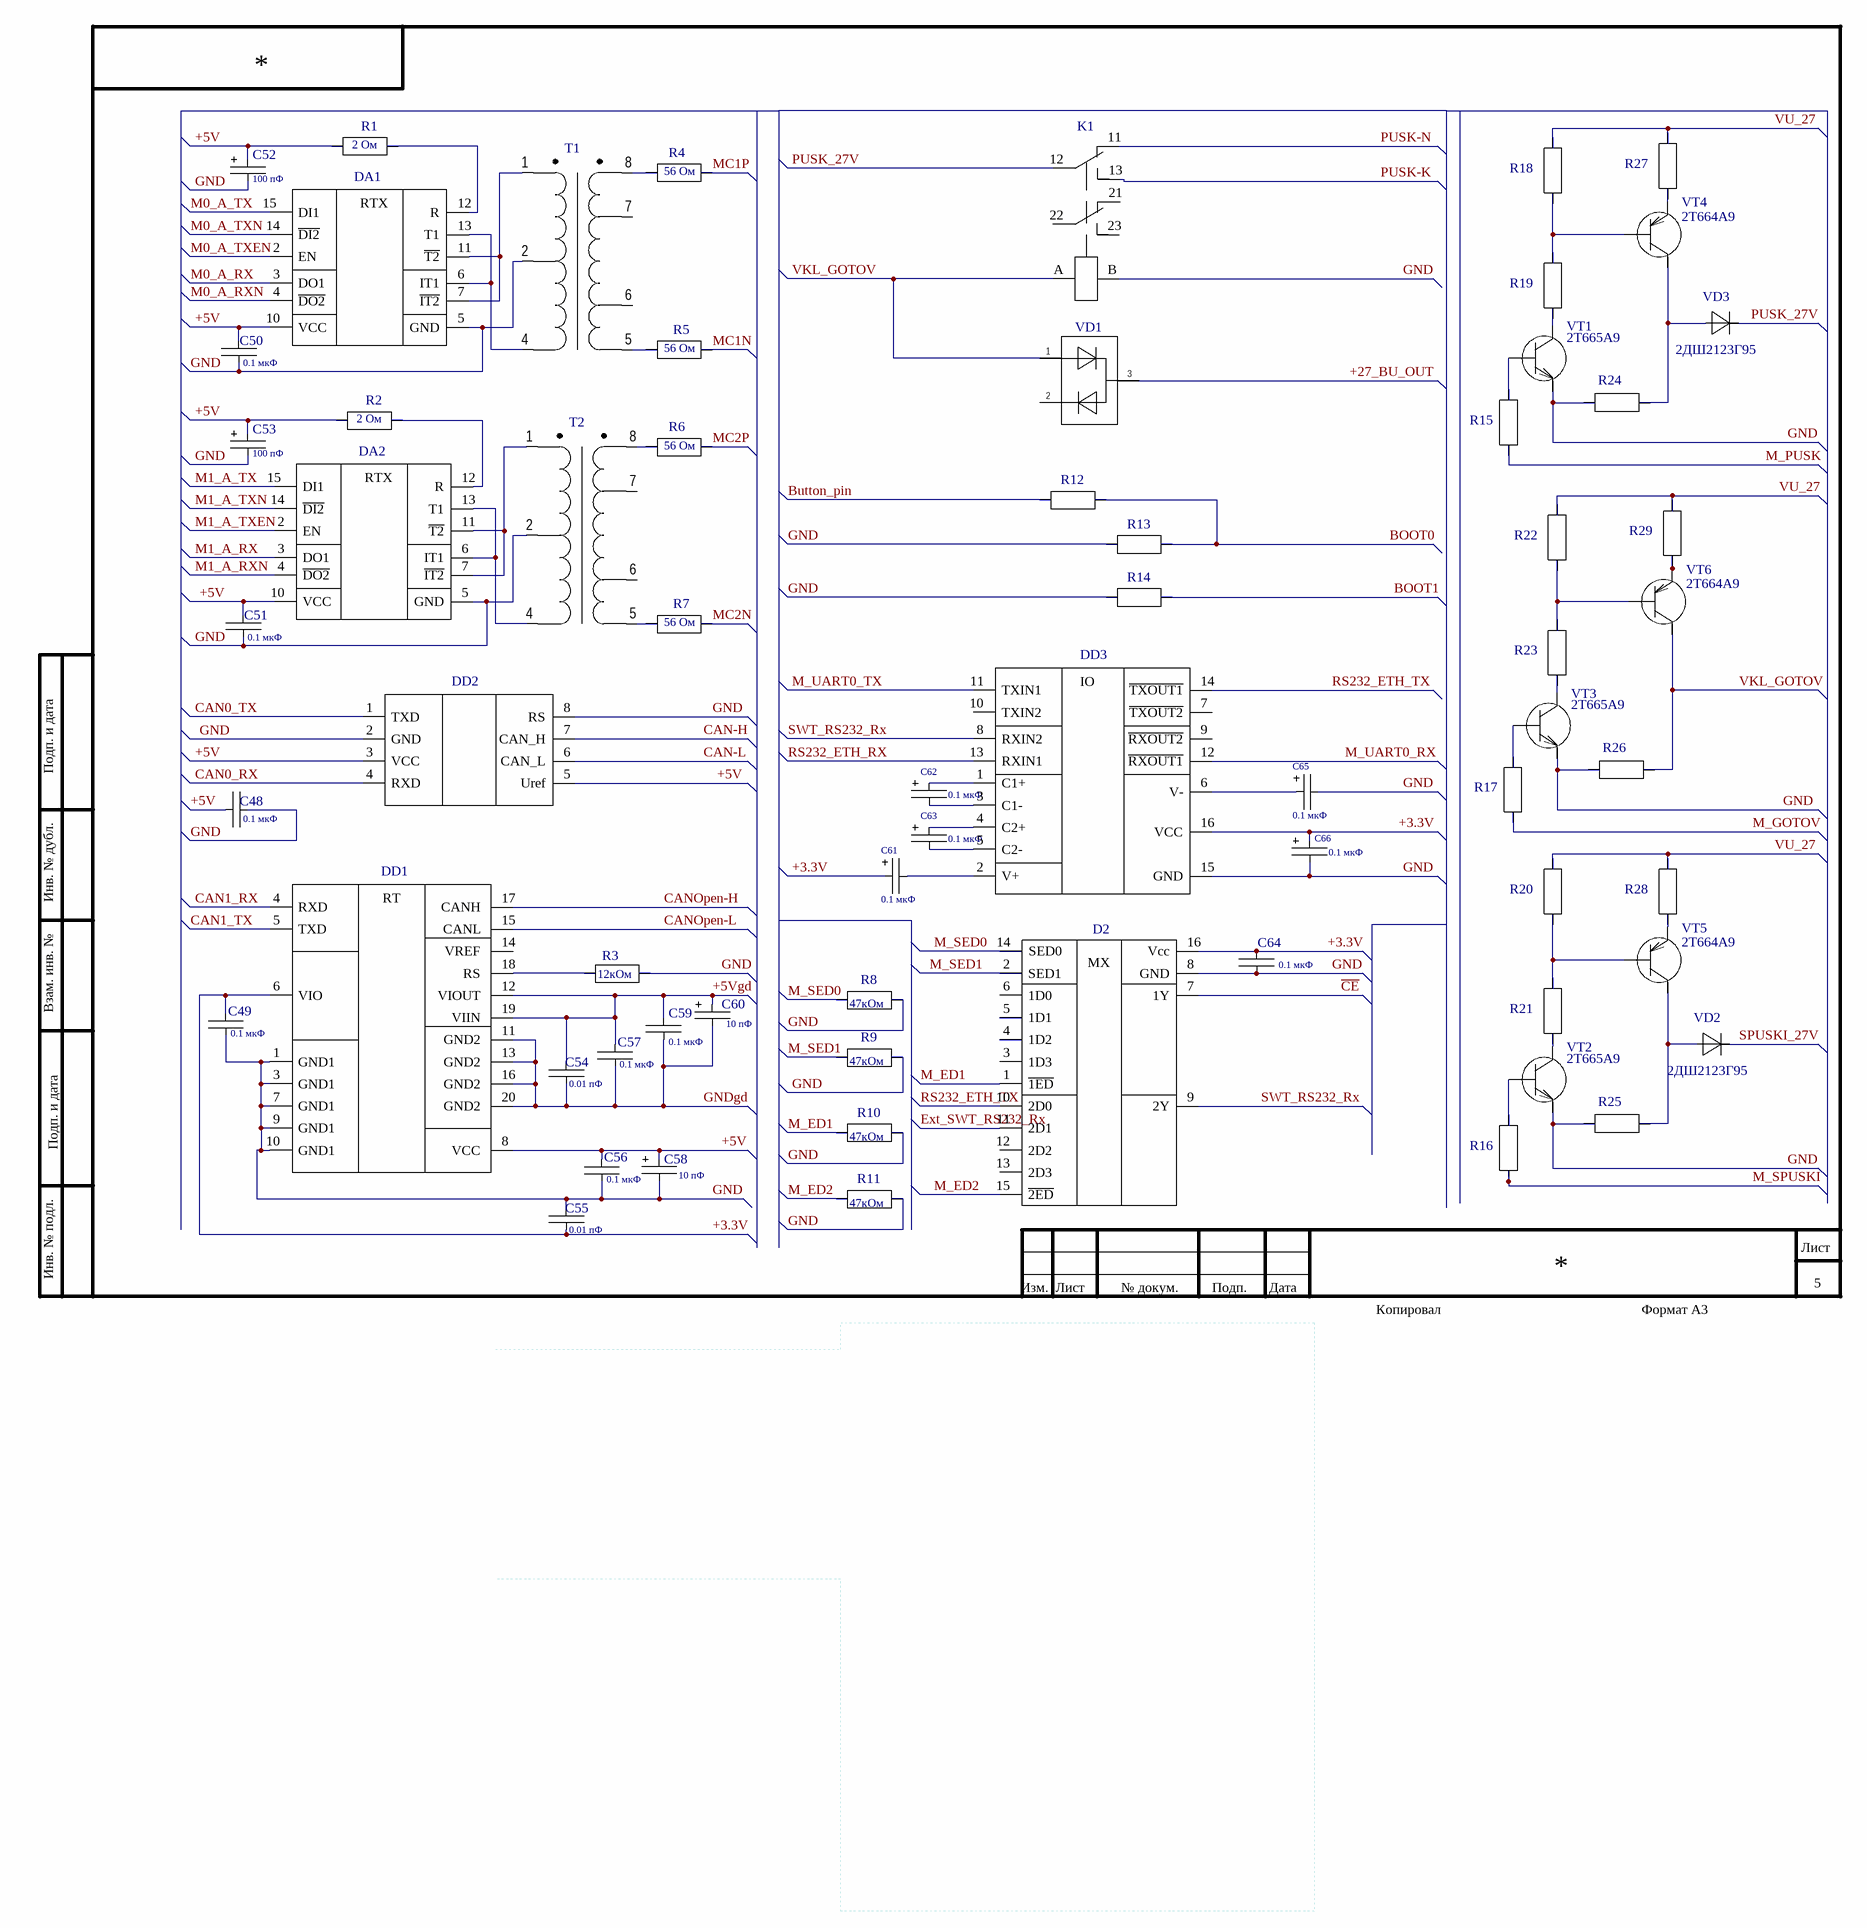
[diagram p4: InterfMCU.SchDoc]

### Parts
C48  0.1 мкФ  [C0805]
C49  0.1 мкФ  [C0805]
C50  0.1 мкФ  [C0805]
C51  0.1 мкФ  [C0805]
C52  100 пФ  [К53-68E]
C53  100 пФ  [К53-68E]
C54  0.01 пФ  [C0805]
C55  0.01 пФ  [C0805]
C56  0.1 мкФ  [C0805]
C57  0.1 мкФ  [C0805]
C58  10 пФ  [К53-67]
C59  0.1 мкФ  [C0805]
C60  10 пФ  [К53-67]
C61  0.1 мкФ  [К53-67]
C62  0.1 мкФ  [К53-67]
C63  0.1 мкФ  [К53-67]
C64  0.1 мкФ  [C0805]
C65  0.1 мкФ  [К53-67]
C66  0.1 мкФ  [К53-67]
D2  1554КП12ТБ  [1554КП12ТБ]  (value not drawn)
DA1  5559ИН13У1  [N09.28-1B]  (value not drawn)
DA2  5559ИН13У1  [N09.28-1B]  (value not drawn)
DD1  ADM3053BRWZ-REEL7_1  [SOIC-20]  (value not drawn)
DD2  ILA82C251D  [SOIC-8]  (value not drawn)
DD3  ILX3232  [SOIC-16]  (value not drawn)
K1  РЭК60  [RELE-REK61_K_RELE-REK-61(Primary)]  (value not drawn)
R1  2 Ом  [P1-12-0.5(1210)]
R2  2 Ом  [P1-12-0.5(1210)]
R3  12кОм  [P1-12-0.125(0805)]
R4  56 Ом  [P1-12-0.5(1210)]
R5  56 Ом  [P1-12-0.5(1210)]
R6  56 Ом  [P1-12-0.5(1210)]
R7  56 Ом  [P1-12-0.5(1210)]
R8  47кОм  [P1-12-0.125(0805)]
R9  47кОм  [P1-12-0.125(0805)]
R10  47кОм  [P1-12-0.125(0805)]
R11  47кОм  [P1-12-0.125(0805)]
R12  47кОм  [P1-12-0.125(0805)]  (value not drawn)
R13  47кОм  [P1-12-0.125(0805)]  (value not drawn)
R14  47кОм  [P1-12-0.125(0805)]  (value not drawn)
R15  47кОм  [P1-12-0.125(0805)]  (value not drawn)
R16  47кОм  [P1-12-0.125(0805)]  (value not drawn)
R17  47кОм  [P1-12-0.125(0805)]  (value not drawn)
R18  47кОм  [P1-12-0.125(0805)]  (value not drawn)
R19  47кОм  [P1-12-0.125(0805)]  (value not drawn)
R20  47кОм  [P1-12-0.125(0805)]  (value not drawn)
R21  47кОм  [P1-12-0.125(0805)]  (value not drawn)
R22  47кОм  [P1-12-0.125(0805)]  (value not drawn)
R23  47кОм  [P1-12-0.125(0805)]  (value not drawn)
R24  47кОм  [P1-12-0.125(0805)]  (value not drawn)
R25  47кОм  [P1-12-0.125(0805)]  (value not drawn)
R26  47кОм  [P1-12-0.125(0805)]  (value not drawn)
R27  47кОм  [P1-12-0.125(0805)]  (value not drawn)
R28  47кОм  [P1-12-0.125(0805)]  (value not drawn)
R29  47кОм  [P1-12-0.125(0805)]  (value not drawn)
VD1  2Д707АС9  [KT-46]  (value not drawn)
VD2  2ДШ2123Г95  [KT-99-1]
VD3  2ДШ2123Г95  [KT-99-1]
VT1  2T665A9  [KT-99-1]
VT2  2T665A9  [KT-99-1]
VT3  2T665A9  [KT-99-1]
VT4  2T664A9  [KT-99-1]
VT5  2T664A9  [KT-99-1]
VT6  2T664A9  [KT-99-1]
Т1  (no value)  [ТИЛ6В]
Т2  (no value)  [ТИЛ6В]

### Nets
+3.3V: C49.1 C55.2 C61.1 C64.1 C66.1 D2.16(Vcc) DD1.6(VIO) DD3.16(VCC)
GND: C48.2 C49.2 C50.2 C51.2 C52.2 C53.2 C55.1 C56.2 C58.2 C64.2 C65.2 C66.2 D2.8(GND) DA1.5(GND) DA2.5(GND) DD1.1(GND1) DD1.3(GND1) DD1.7(GND1) DD1.9(GND1) DD1.10(GND1) DD2.2(GND) DD2.8(RS) DD3.15(GND) K1.B R3.2 R8.2 R9.2 R10.2 R11.2 R13.1 R14.1 R24.2 R25.2 R26.2 VT1.1 VT2.1 VT3.1 Т1.2 Т2.2
+5V: C48.1 C50.1 C51.1 C52.1 C53.1 C56.1 C58.1 DA1.10(VCC) DA2.10(VCC) DD1.8(VCC) DD2.3(VCC) DD2.5(Uref) R1.1 R2.1
+5VGD: C54.1 C57.1 C59.1 C60.1 DD1.12(VIOUT) DD1.19(VIIN)
+27_BU_OUT: VD1.3
~{CE}: D2.7(1Y)
BOOT0: R12.2 R13.2
BOOT1: R14.2
Button_pin: R12.1
CAN0_RX: DD2.4(RXD)
CAN0_TX: DD2.1(TXD)
CAN1_RX: DD1.4(RXD)
CAN1_TX: DD1.5(TXD)
CAN-H: DD2.7(CAN_H)
CAN-L: DD2.6(CAN_L)
CANOpen-H: DD1.17(CANH)
CANOpen-L: DD1.15(CANL)
Ext_SWT_RS232_Rx: D2.11(2D1)
GNDgd: C54.2 C57.2 C59.2 C60.2 DD1.11(GND2) DD1.13(GND2) DD1.16(GND2) DD1.20(GND2)
M0_A_RX: DA1.3(DO1)
M0_A_RXN: DA1.4(~{DO2})
M0_A_TX: DA1.15(DI1)
M0_A_TXEN: DA1.2(EN)
M0_A_TXN: DA1.14(~{DI2})
M1_A_RX: DA2.3(DO1)
M1_A_RXN: DA2.4(~{DO2})
M1_A_TX: DA2.15(DI1)
M1_A_TXEN: DA2.2(EN)
M1_A_TXN: DA2.14(~{DI2})
M_ED1: D2.1(~{1ED}) R10.1
M_ED2: D2.15(~{2ED}) R11.1
M_GOTOV: R17.1
M_PUSK: R15.1
M_SED0: D2.14(SED0) R8.1
M_SED1: D2.2(SED1) R9.1
M_SPUSKI: R16.1
M_UART0_RX: DD3.12(~{RXOUT1})
M_UART0_TX: DD3.11(TXIN1)
MC1N: R5.2
MC1P: R4.2
MC2N: R7.2
MC2P: R6.2
PUSK-K: K1.13
PUSK-N: K1.11
PUSK_27V: K1.12 VD3.3
RS232_ETH_RX: DD3.13(RXIN1)
RS232_ETH_TX: D2.10(2D0) DD3.14(~{TXOUT1})
SPUSKI_27V: VD2.3
SWT_RS232_Rx: D2.9(2Y) DD3.8(RXIN2)
VKL_GOTOV: K1.A R26.1 VD1.1 VT6.2
VU_27: R18.2 R20.2 R22.2 R27.2 R28.2 R29.2
NetC61_2: C61.2 DD3.2(V+)
NetC62_1: C62.1 DD3.1(С1+)
NetC62_2: C62.2 DD3.3(С1-)
NetC63_1: C63.1 DD3.4(C2+)
NetC63_2: C63.2 DD3.5(C2-)
NetC65_1: C65.1 DD3.6(V-)
NetDA1_6: DA1.6(IT1) DA1.13(T1) Т1.4
NetDA1_7: DA1.7(~{IT2}) DA1.11(~{T2}) Т1.1
NetDA1_12: DA1.12(R) R1.2
NetDA2_6: DA2.6(IT1) DA2.13(T1) Т2.4
NetDA2_7: DA2.7(~{IT2}) DA2.11(~{T2}) Т2.1
NetDA2_12: DA2.12(R) R2.2
NetDD1_18: DD1.18(RS) R3.1
NetR4_1: R4.1 Т1.8
NetR5_1: R5.1 Т1.5
NetR6_1: R6.1 Т2.8
NetR7_1: R7.1 Т2.5
NetR15_2: R15.2 VT1.3
NetR16_2: R16.2 VT2.3
NetR17_2: R17.2 VT3.3
NetR18_1: R18.1 R19.2 VT4.3
NetR19_1: R19.1 VT1.2
NetR20_1: R20.1 R21.2 VT5.3
NetR21_1: R21.1 VT2.2
NetR22_1: R22.1 R23.2 VT6.3
NetR23_1: R23.1 VT3.2
NetR24_1: R24.1 VD3.2 VT4.2
NetR25_1: R25.1 VD2.2 VT5.2
NetR27_1: R27.1 VT4.1
NetR28_1: R28.1 VT5.1
NetR29_1: R29.1 VT6.1

Not connected (* = marked no-connect by the designer): D2 3(1D3) 4(1D2) 5(1D1) 6(1D0) 12(2D2) 13(2D3); DD1 14(VREF_); DD3 7(~{TXOUT2}) 9(~{RXOUT2}) 10(TXIN2); K1 21 22 23; VD1 2; Т1 6 7; Т2 6 7

### Notes on the sheet
- Подп. и дата
- Инв. № дубл.
- Взам. инв. №
- Инв. № подл.
- Изм.
- Лист
- № докум.
- Подп.
- Дата
- Копировал
- Формат А3
- (in symbol 1554КП12ТБ) MX
- (in symbol 5559ИН13У1) RTX
- (in symbol ADM3053BRWZ-REEL7_1) RT
- (in symbol ILX3232) IO

### Library data of the parts
C48 C50 C51 C64 = К10-69_0.1mk: Керамический чип-конденсатор серии К10-79; PartNumber: К10-69в-*-* В- * ± *% *; TypePrefix: C; TU: АЖЯР.673511.002ТУ; TUHolder: ОАО НИИ "ГИРИКОНД"; Value: *; PackegeType: *
C49 C56 C57 C59 = К10-69_0.1mk: as C3 on sheet MCU1; Value: *; PackegeType: *
C52 C53 = К53-68E: Конденсатор полярный
C54 C55 = К10-69_0.01p: Керамический чип-конденсатор серии К10-79; PartNumber: К10-69в-*-* В- * ± *% *; TypePrefix: C; TU: АЖЯР.673511.002ТУ; TUHolder: ОАО НИИ "ГИРИКОНД"; Value: *; PackegeType: *
C58 C60 = К53-68B: Конденсатор / полярный
C61-C63 C65 C66 = К53-68B_0.1mk: Конденсатор / полярный; PartNumber: К53-68 "C" - 25В - 4.7мкФ ±10%; Value: 4.7мкФ; TU: АЖЯР.673546.007; TUHolder: ОАО "Элеконд", Россия, г.Сарапул; Prefix: C; TypePrefix: Конденсатор; TypeName: *
D2 = 1554КП12ТБ: Два селектор-мультиплексора 4-1; TU: АЕЯР.431200.182-15ТУ; TUHolder: "Интеграл"; TypePrefix: D; PackegeType: 402.16-32; PartNumber: 1554КП12ТБ
DA1 DA2 = 5559ИН13У1: МКИО приемопередатчик 5559ИН13Т; TypePrefix: Приемопердатчик МКИО; TU: АЕЯР.431230.591ТУ; TUHolder: ОАО НПО "Физика",Россия, г. Москва; Prefix: DA; TipeName: Приемопередатчики; Value: *; PartNumber: 5559ИН13У1
DD1 = ADM3053BRWZ-REEL7_1: Микросборка CAN с гальванической развязкой; TypePrefix: Приемопередатчик; TUHolder: Analog Devices, США; Prefix: DD; TypeName: Приемопередатчики; Value: *; PartNumber: ADM3053BRWZ-REEL7_1; TU: *
DD2 = ILA82C251D: CAN Приемопередатчик  ILA82C251D; TypePrefix: Приемопередатик CAN; TUHolder: ОАО "ИНТЕГРАЛ", Республика Беларусь, г.Минск; Prefix: DD; TipeName: Приемопередатчики; Value: *; PartNumber: ILA82C251D; TU: *
DD3 = ILX3232: RS-232 Приемопередатчик ILX3232; TypePrefix: Приемопередатчик RS-232; TUHolder: ОАО "ИНТЕГРАЛ", Республика Беларусь, г.Минск; Prefix: DD; TypeName: Приемопередатчики; Value: *; PartNumber: ILX3232; TU: *
K1 = РЭК60: Value: Реле РЭК61В РВИМ.647611.008-18; TU: РВИМ.647611.008ТУ
R1 R2 = Р1-12-0,5: Резистор постоянный
R3 = Р1-12-0,125: Резистор постоянный
R4-R7 = Р1-12-0,5_56: Резистор постоянный
R8-R29 = Р1-12_47k: as R30 on sheet InternalConnection; PackegeType: *; Value: *
VD1 = 2Д707АС9: as VD4 on sheet ExternalConnection; Value: *; PartNumber: 2Д707АС9
VD2 VD3 = 2ДШ2123Г95: Диод Шоттки; TU: АЕЯР.432120.567ТУ; PackegeType: КТ-99-1; TUHolder: ОА ВЗПП-С; TypePrefix: VD; Value: *; PartNumber: 2ДШ2123Г95
VT1-VT3 = 2T665A9: npn кремниевый транзистор; PackegeType: КТ-47; TU: аА0.339.559ТУ; TUHolder: ЗАО "Группа Кремний Эл"; TypePrefix: Транзистор; PartNumber: 2T665A9
VT4-VT6 = 2T664A9: pnp кремниевый транзистор; PackegeType: КТ-47; TU: аА0.339.559ТУ; TUHolder: ЗАО "Группа Кремний Эл"; TypePrefix: Транзистор; PartNumber: 2T664A9
Т1 Т2 = ТИЛ6В: Трансформатор для ГОСТ Р 52070-2003